# EAGLE design MSP-EXP430FR2311 (EAGLE 6.6.0)
REV: 1.0

## Sheet 1 of 6
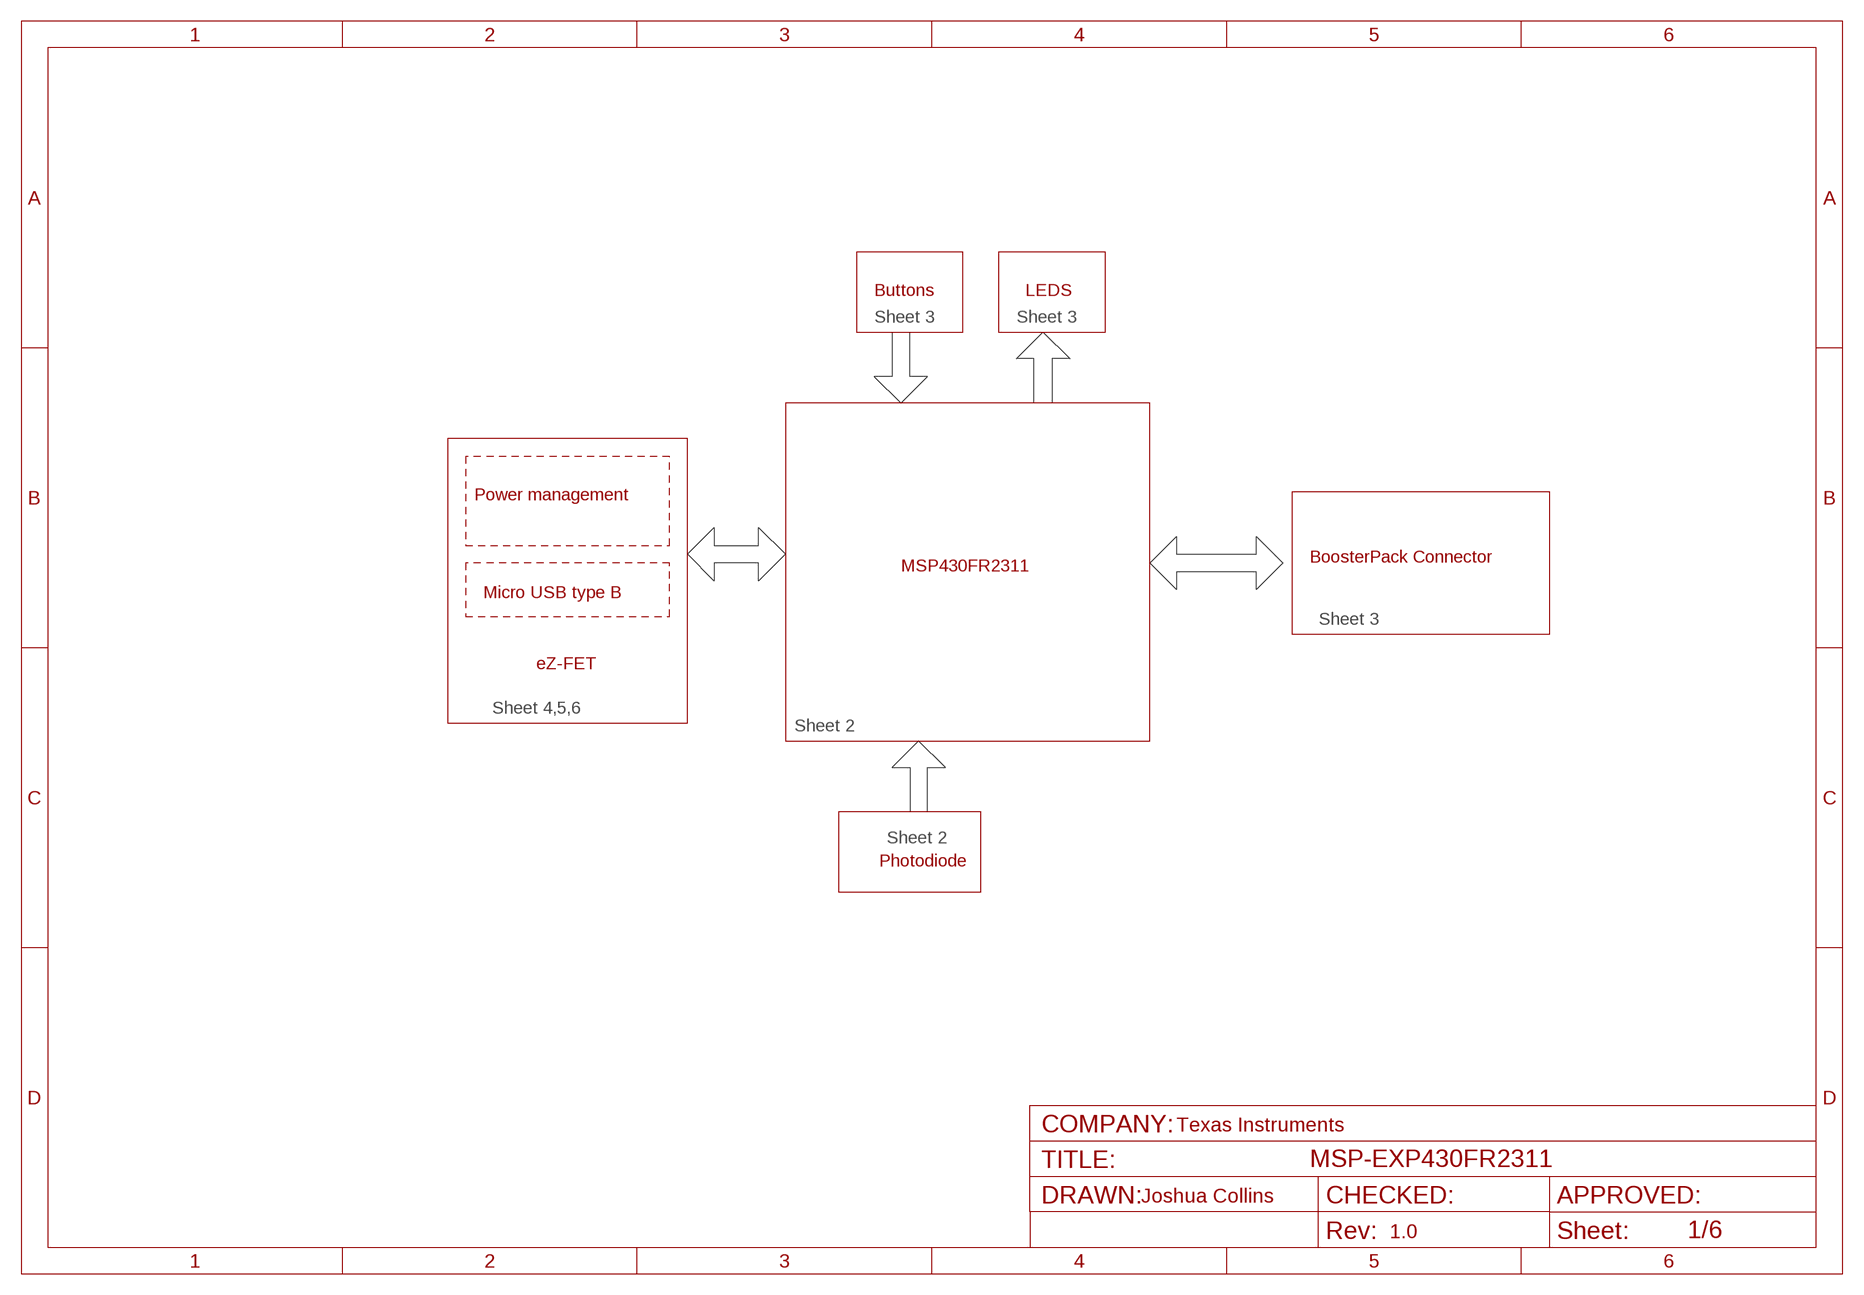
[diagram p0: schematic, sheet 1]

### Notes on the sheet
- Buttons | LEDS
- Sheet 3 | Sheet 3
- Power management
- BoosterPack Connector
- MSP430FR2311
- Micro USB type B
- Sheet 3
- eZ-FET
- Sheet 4,5,6
- Sheet 2
- Sheet 2
- Photodiode
- Texas Instruments
- Joshua Collins

## Sheet 2 of 6
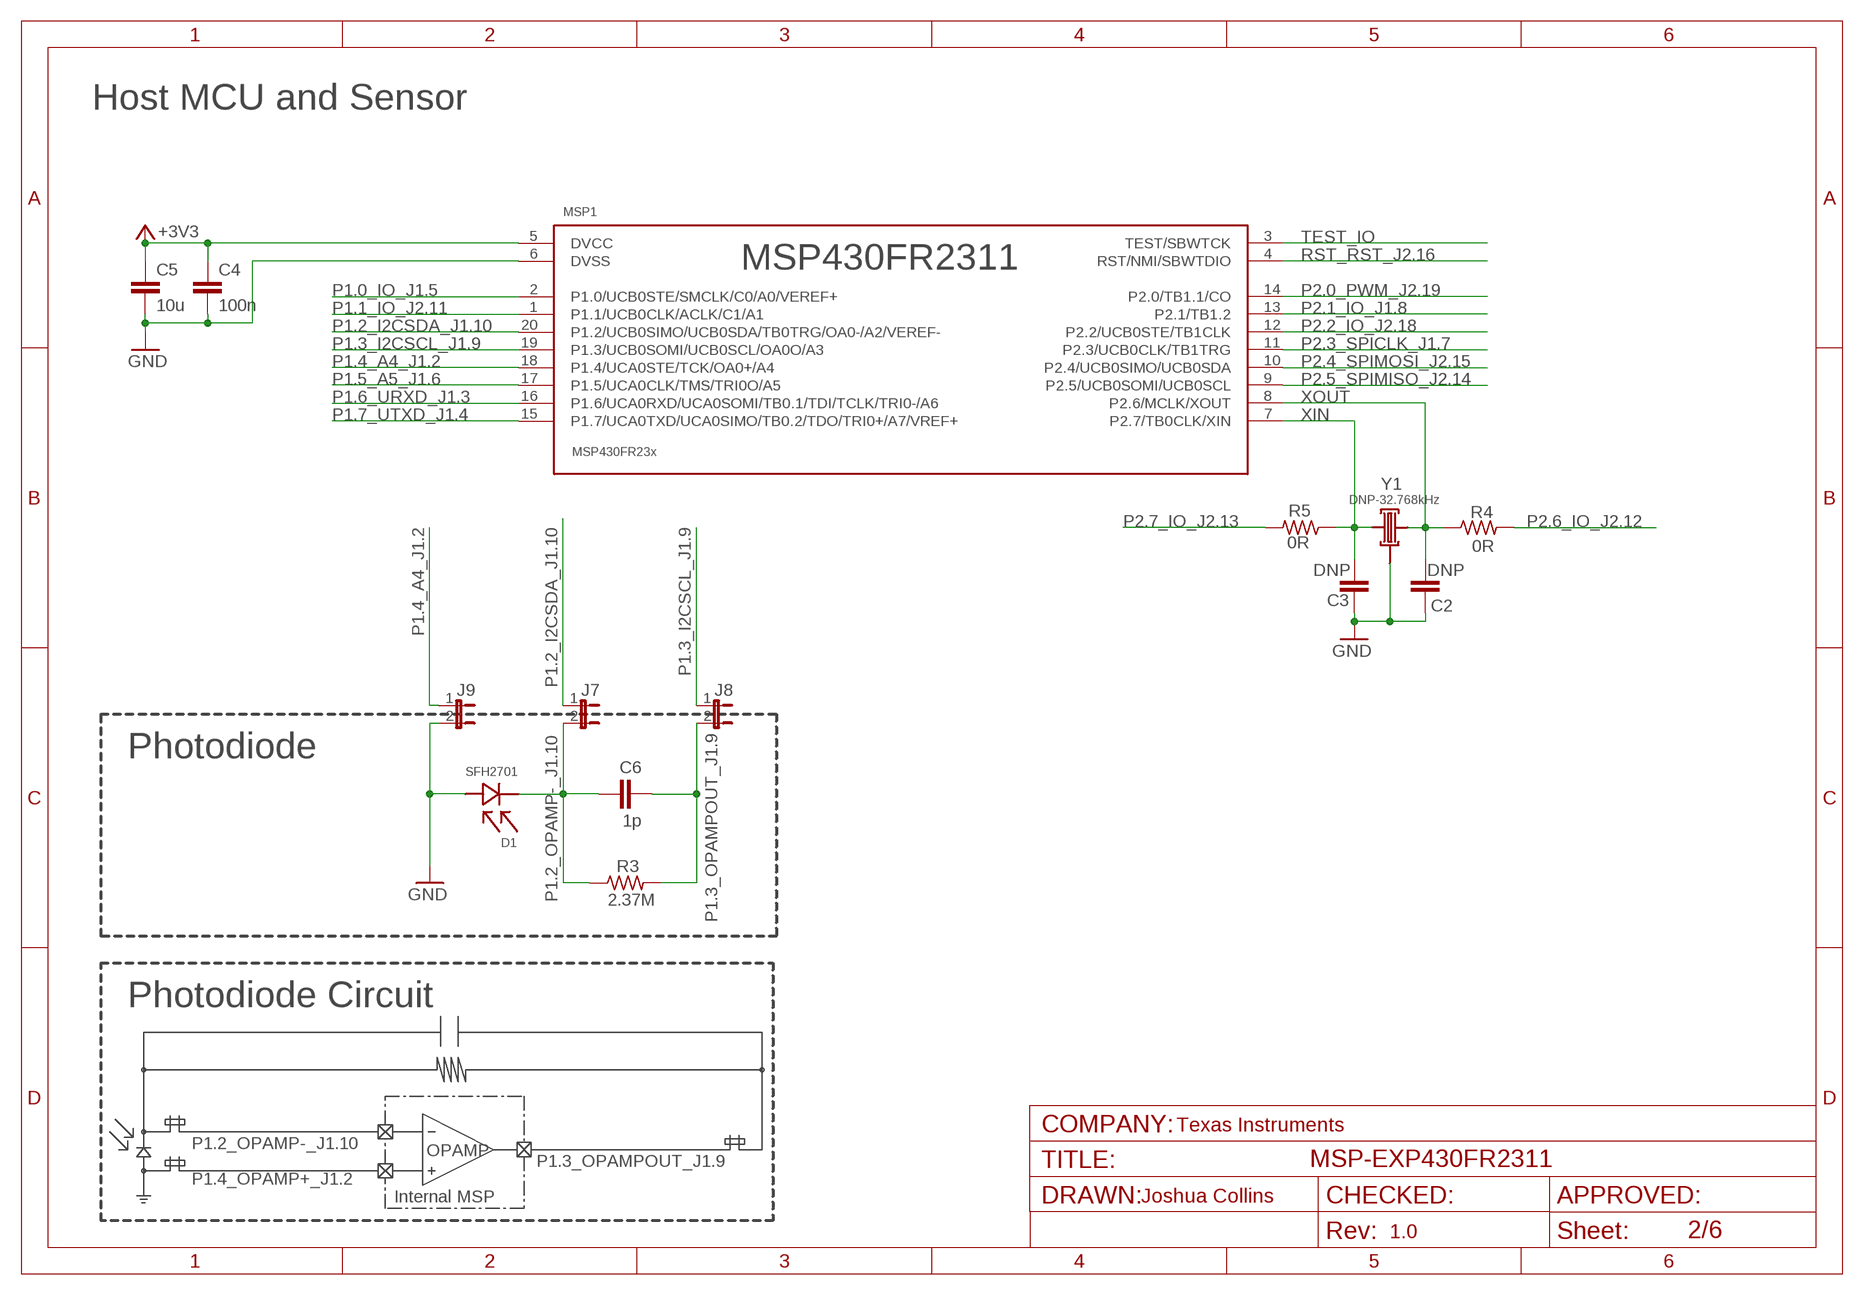
[diagram p1: schematic, sheet 2]

### Parts
C2  DNP  C-EUCM0402  [0402]
C3  DNP  C-EUCM0402  [0402]
C4  100n  C-EUCM0402  [0402]
C5  10u  C-EUC0603  [C0603]
C6  1p  C-EUC0603  [C0603]
D1  SFH2701  [1206-OSRAM]
J7  JUMPER_2.51MM  [JUMPER-2.54]
J8  JUMPER_2.51MM  [JUMPER-2.54]
J9  JUMPER_2.51MM  [JUMPER-2.54]
MSP1  MSP430FR2311IPW20"  [PW20]
R3  2.37M  RESR0603  [0603]
R4  0R  R-US_RM0402  [0402]
R5  0R  R-US_RM0402  [0402]
Y1  DNP - 32.768kHz  MULTI-CRYSTAL  [MULTI-CRYSTAL]

### Nets
+3V3: C4.1 C5.1 MSP1.5(DVCC) ; also sheet 3,5
P1.0_IO_J1.5: MSP1.2(P1.0/UCB0STE/SMCLK/C0/A0/VEREF+) ; also sheet 3
P1.1_IO_J2.11: MSP1.1(P1.1/UCB0CLK/ACLK/C1/A1) ; also sheet 3
P1.2_I2CSDA_J1.10: J7.1 MSP1.20(P1.2/UCB0SIMO/UCB0SDA/TB0TRG/OA0-/A2/VEREF-) ; also sheet 3
P1.2_OPAMP-_J1.10: C6.1 D1.C J7.2 R3.1
P1.3_I2CSCL_J1.9: J8.1 MSP1.19(P1.3/UCB0SOMI/UCB0SCL/OA0O/A3) ; also sheet 3
P1.3_OPAMPOUT_J1.9: C6.2 J8.2 R3.2
P1.4_A4_J1.2: J9.1 MSP1.18(P1.4/UCA0STE/TCK/OA0+/A4) ; also sheet 3
P1.5_A5_J1.6: MSP1.17(P1.5/UCA0CLK/TMS/TRI0O/A5) ; also sheet 3
P1.6_URXD_J1.3: MSP1.16(P1.6/UCA0RXD/UCA0SOMI/TB0.1/TDI/TCLK/TRI0-/A6) ; also sheet 3,5
P1.7_UTXD_J1.4: MSP1.15(P1.7/UCA0TXD/UCA0SIMO/TB0.2/TDO/TRI0+/A7/VREF+) ; also sheet 3,5
P2.0_PWM_J2.19: MSP1.14(P2.0/TB1.1/CO) ; also sheet 3
P2.1_IO_J1.8: MSP1.13(P2.1/TB1.2) ; also sheet 3
P2.2_IO_J2.18: MSP1.12(P2.2/UCB0STE/TB1CLK) ; also sheet 3
P2.3_SPICLK_J1.7: MSP1.11(P2.3/UCB0CLK/TB1TRG) ; also sheet 3
P2.4_SPIMOSI_J2.15: MSP1.10(P2.4/UCB0SIMO/UCB0SDA) ; also sheet 3
P2.5_SPIMISO_J2.14: MSP1.9(P2.5/UCB0SOMI/UCB0SCL) ; also sheet 3
P2.6_IO_J2.12: R4.2 ; also sheet 3
P2.7_IO_J2.13: R5.2 ; also sheet 3
RST_RST_J2.16: MSP1.4(RST/NMI/SBWTDIO) ; also sheet 3,5
TEST_IO: MSP1.3(TEST/SBWTCK) ; also sheet 5
TGT_GND: C2.2 C3.2 C4.2 C5.2 D1.A J9.2 MSP1.6(DVSS) Y1.GND@0(GND) ; supply symbol labelled GND ; also sheet 3,5
XIN: C3.1 MSP1.7(P2.7/TB0CLK/XIN) R5.1 Y1.1
XOUT: C2.1 MSP1.8(P2.6/MCLK/XOUT) R4.1 Y1.2

### Notes on the sheet
- Host MCU and Sensor
- MSP430FR2311
- DNP-32.768kHz
- Photodiode
- Photodiode Circuit
- Texas Instruments
- P1.2_OPAMP-_J1.10
- OPAMP
- P1.3_OPAMPOUT_J1.9
- P1.4_OPAMP+_J1.2
- Internal MSP | Joshua Collins

## Sheet 3 of 6
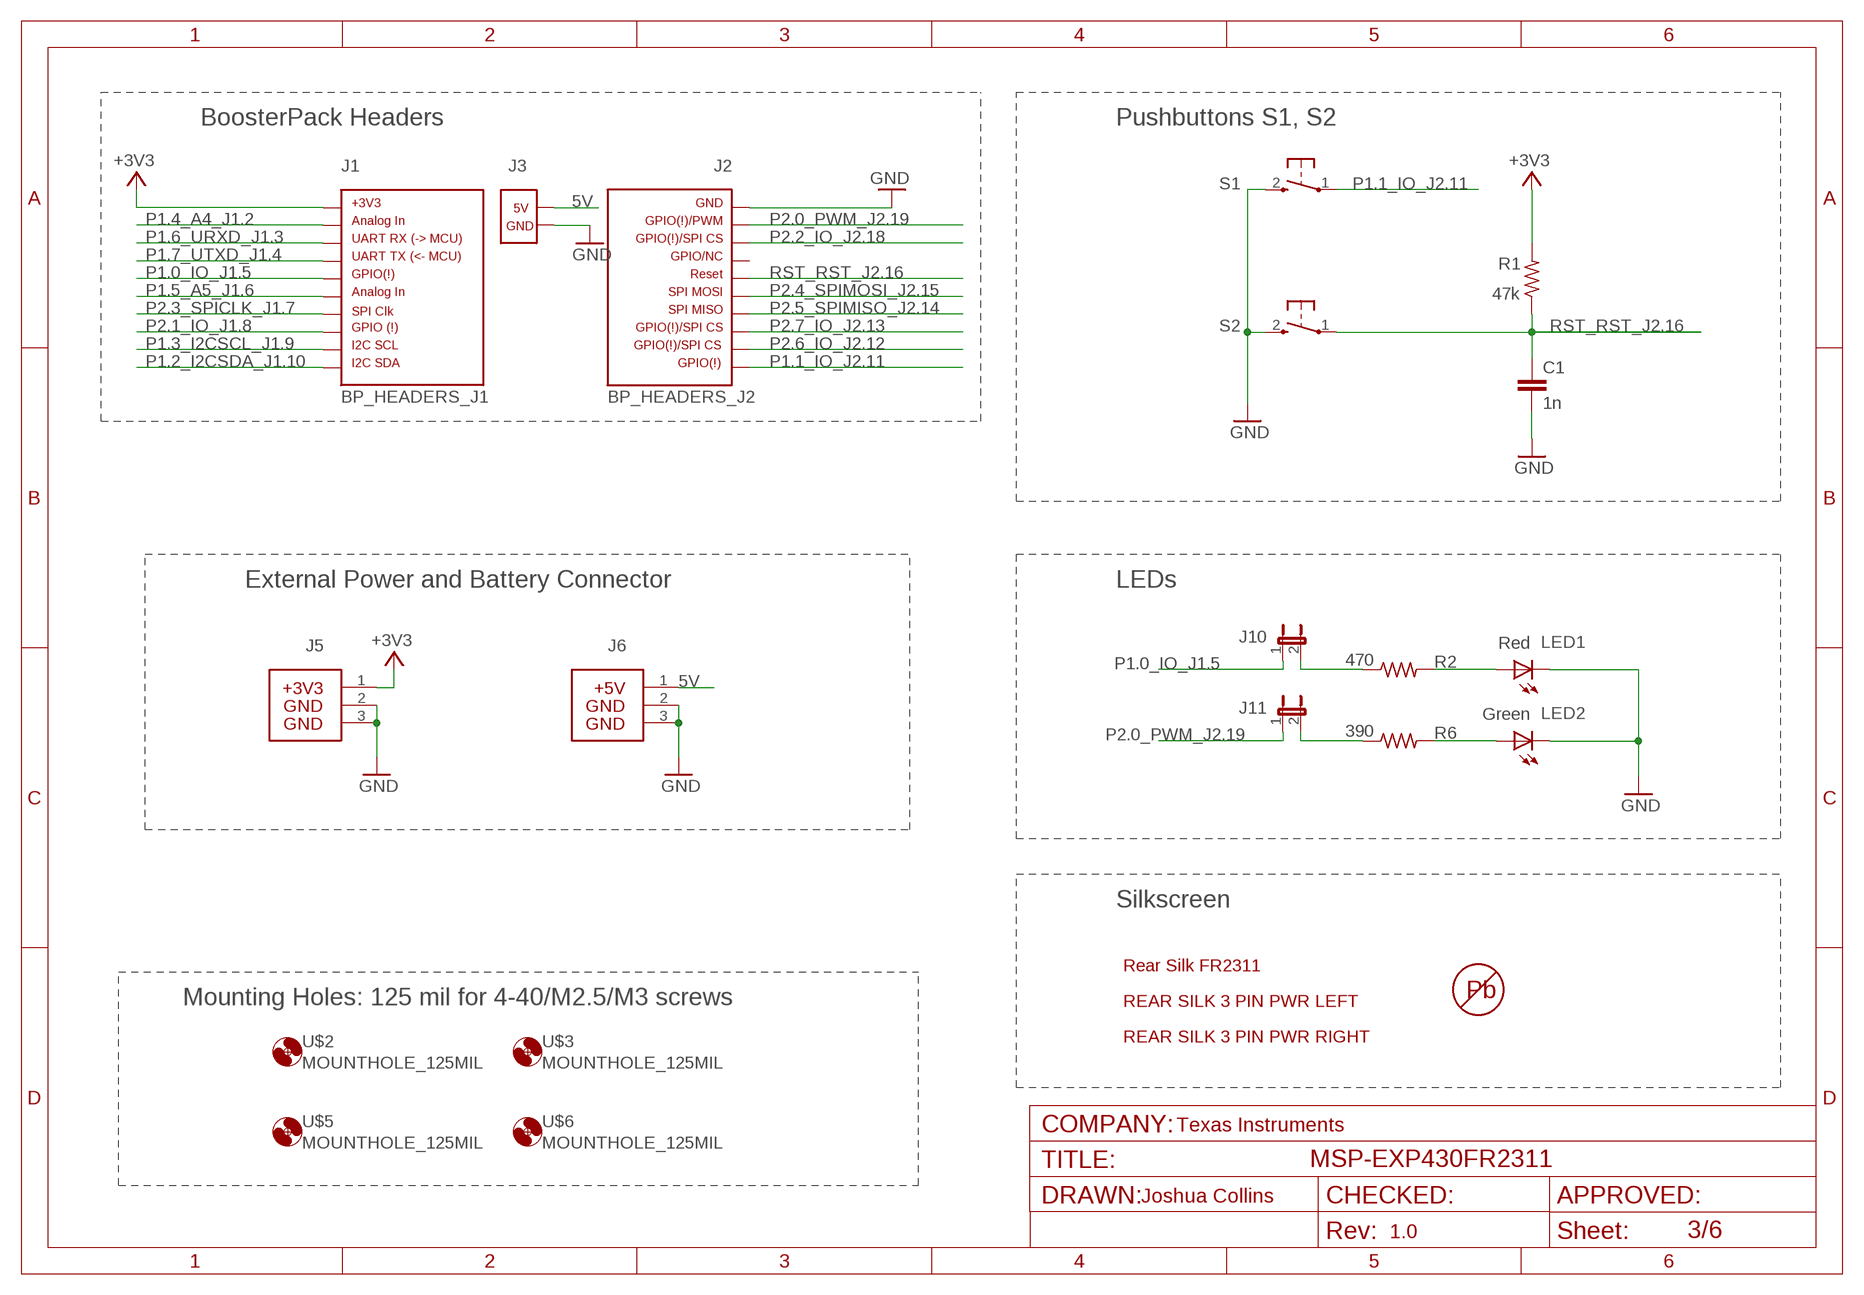
[diagram p2: schematic, sheet 3]

### Parts
C1  1n  C-EUCM0402  [0402]
J1  BP_HEADERS_J1  [J1]
J2  BP_HEADERS_J2  [J2]
J3  BP_2PIN_J3_HEADER  [2PIN_PWR_5V]
J5  HEADER 1X03  BP_HEADERS_PWR_3V3100-TH  [3PIN_PWR_3V3]
J6  BP_HEADERS_PWR_5V  [3PIN_PWR_5V]
J10  JUMPER_2.51MM  [JUMPER-2.54]
J11  JUMPER_2.51MM  [JUMPER-2.54]
LED1  Red  CHIP-LED  [LED0805]
LED2  Green  CHIP-LED  [LED0805]
R1  47k  R-US_RM0402  [0402]
R2  470  R-US_RM0402  [0402]
R6  390  R-US_RM0402  [0402]
S1  PB  [PBTH]
S2  PB  [PBTH]
U$1  REAR_SILK_FR2311  [SILK_REAR_FR2311]
U$2  MOUNTHOLE_125MIL  [MOUNTHOLE_125MIL]
U$3  MOUNTHOLE_125MIL  [MOUNTHOLE_125MIL]
U$5  MOUNTHOLE_125MIL  [MOUNTHOLE_125MIL]
U$6  MOUNTHOLE_125MIL  [MOUNTHOLE_125MIL]
U$7  PB-FREE  [PB-FREE]
U$8  BP_3PIN_SILK  [3PIN_PWR_SILK]
U$9  P  [P]
U$10  BP_3PIN_SILK_RT  [3PIN_PWR_SILK_RT]

### Nets
5V: J3.21 J6.1 ; also sheet 5
+3V3: J1.1 J5.1 R1.2 ; also sheet 2,5
N$3: J11.2 R6.1
N$4: LED2.A R6.2
N$6: J10.2 R2.1
N$7: LED1.A R2.2
P1.0_IO_J1.5: J1.5 J10.1 ; also sheet 2
P1.1_IO_J2.11: J2.11 S1.1(P) ; also sheet 2
P1.2_I2CSDA_J1.10: J1.10 ; also sheet 2
P1.3_I2CSCL_J1.9: J1.9 ; also sheet 2
P1.4_A4_J1.2: J1.2 ; also sheet 2
P1.5_A5_J1.6: J1.6 ; also sheet 2
P1.6_URXD_J1.3: J1.3 ; also sheet 2,5
P1.7_UTXD_J1.4: J1.4 ; also sheet 2,5
P2.0_PWM_J2.19: J2.19 J11.1 ; also sheet 2
P2.1_IO_J1.8: J1.8 ; also sheet 2
P2.2_IO_J2.18: J2.18 ; also sheet 2
P2.3_SPICLK_J1.7: J1.7 ; also sheet 2
P2.4_SPIMOSI_J2.15: J2.15 ; also sheet 2
P2.5_SPIMISO_J2.14: J2.14 ; also sheet 2
P2.6_IO_J2.12: J2.12 ; also sheet 2
P2.7_IO_J2.13: J2.13 ; also sheet 2
RST_RST_J2.16: C1.1 J2.16 R1.1 S2.1(P) ; also sheet 2,5
TGT_GND: C1.2 J2.20 J3.22 J5.2 J5.3 J6.2 J6.3 LED1.C LED2.C S1.2(S) S2.2(S) ; supply symbol labelled GND ; also sheet 2,5
Unconnected: J2.17

### Notes on the sheet
- BoosterPack Headers | Pushbuttons S1, S2
- External Power and Battery Connector | LEDs
- Silkscreen
- Mounting Holes: 125 mil for 4-40/M2.5/M3 screws
- Texas Instruments
- Joshua Collins

## Sheet 4 of 6
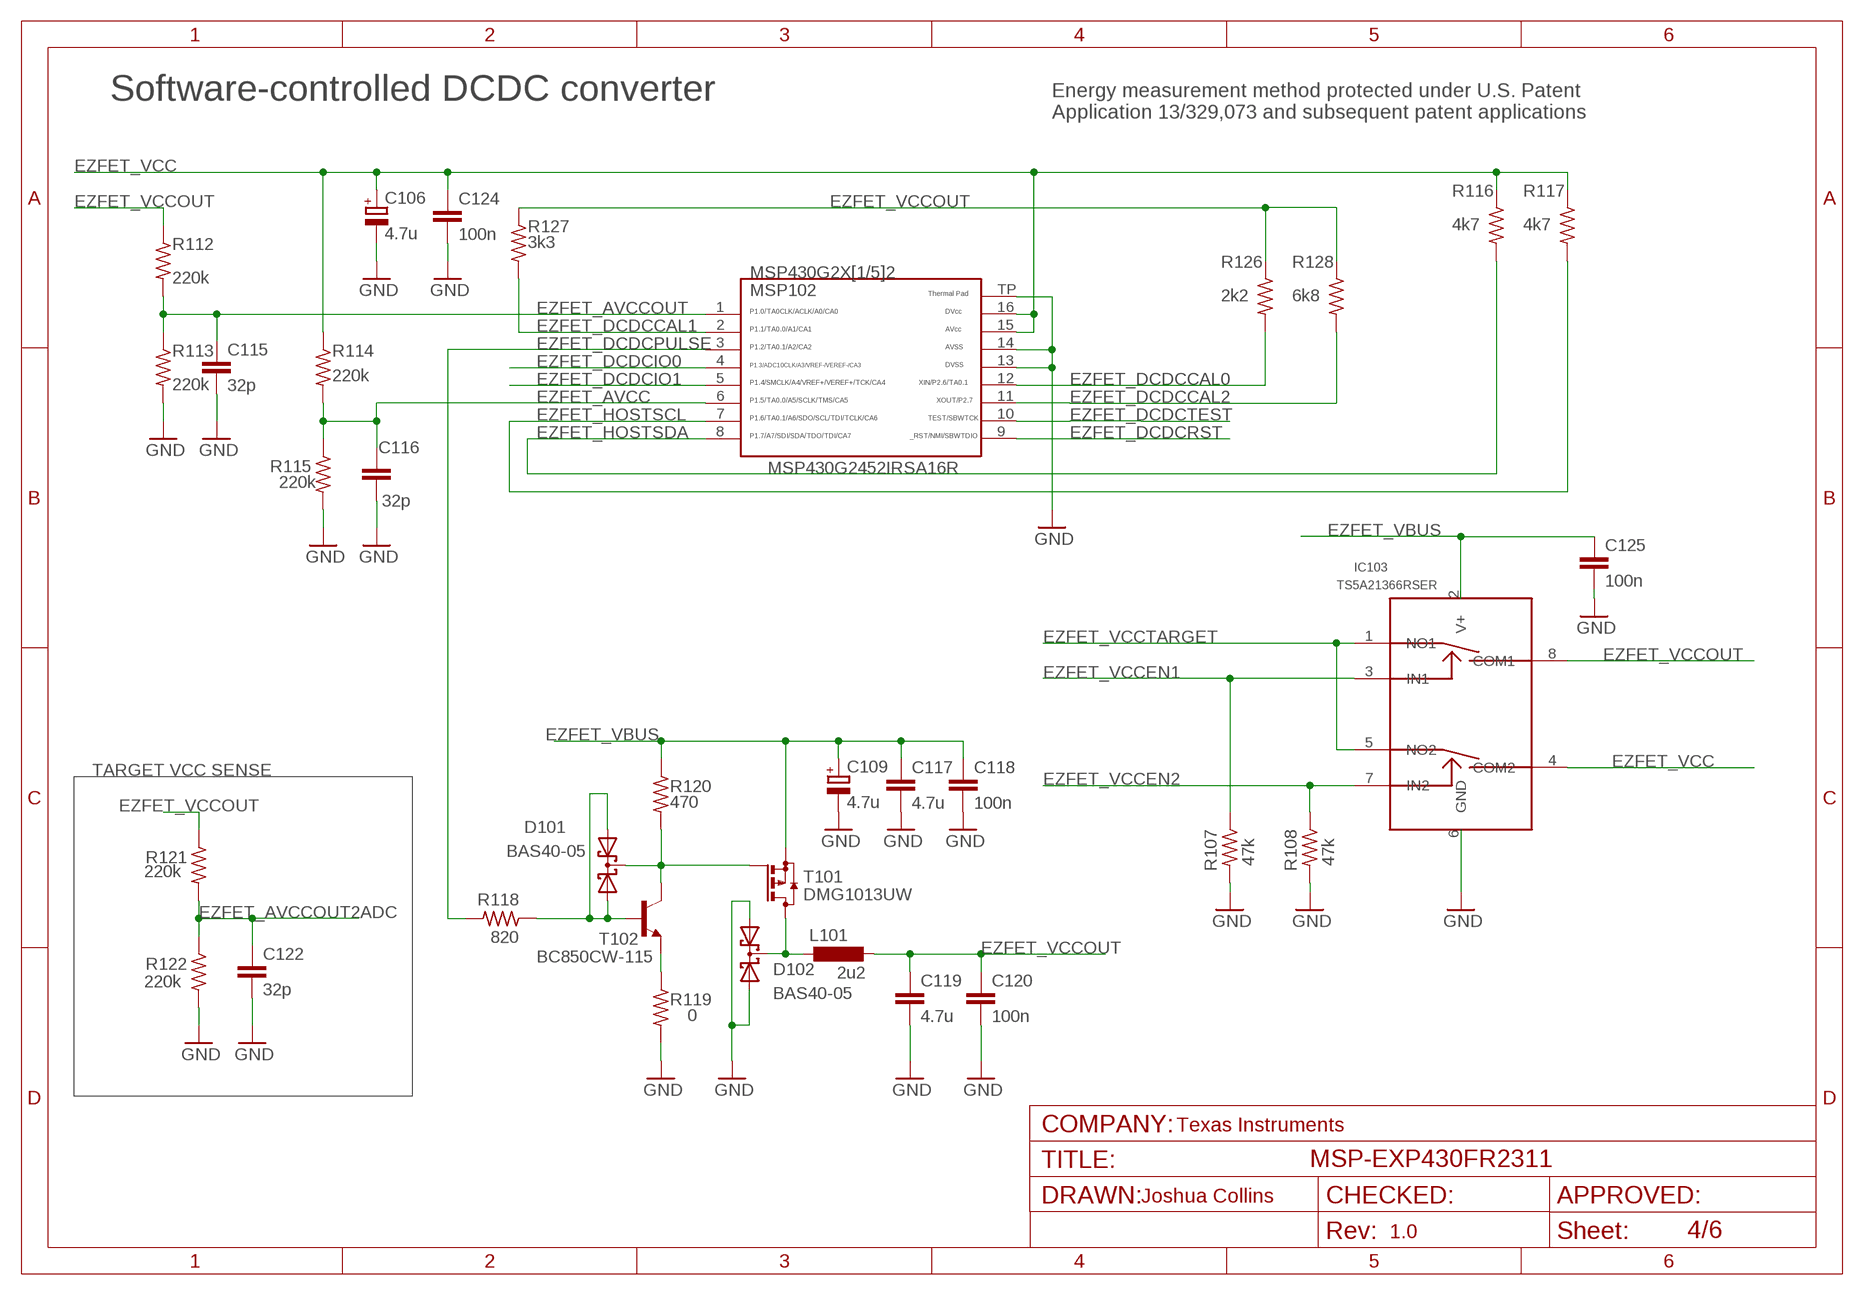
[diagram p3: schematic, sheet 4]

### Parts
C106  4.7u  CPOL-EUA/3216-18R  [A/3216-18R]
C109  4.7u  CPOL-EUA/3216-18R  [A/3216-18R]
C115  32p  C-EUCM0402  [0402]
C116  32p  C-EUCM0402  [0402]
C117  4.7u  C-EUC0603  [C0603]
C118  100n  C-EUCM0402  [0402]
C119  4.7u  C-EUC0603  [C0603]
C120  100n  C-EUCM0402  [0402]
C122  32p  C-EUCM0402  [0402]
C124  100n  C-EUCM0402  [0402]
C125  100n  C-EUCM0402  [0402]
D101  BAS40-05  BAS40-05W  [SOT323]
D102  BAS40-05  BAS40-05W  [SOT323]
IC103  TS5A21366RSER  [UQFN_RSE]
L101  2u2  L-EUL3216C  [L3216C]
MSP102  MSP430G2452IRSA16R  G2X[1/5]2---RSA16  [RSA16]
R107  47k  R-US_RM0402  [0402]
R108  47k  R-US_RM0402  [0402]
R112  220k  R-US_RM0402  [0402]
R113  220k  R-US_RM0402  [0402]
R114  220k  R-US_RM0402  [0402]
R115  220k  R-US_RM0402  [0402]
R116  4k7  R-US_RM0402  [0402]
R117  4k7  R-US_RM0402  [0402]
R118  820  R-US_RM0402  [0402]
R119  0  R-US_RM0402  [0402]
R120  470  R-US_RM0402  [0402]
R121  220k  R-US_RM0402  [0402]
R122  220k  R-US_RM0402  [0402]
R126  2k2  R-US_RM0402  [0402]
R127  3k3  R-US_RM0402  [0402]
R128  6k8  R-US_RM0402  [0402]
T101  DMG1013UW  [SOT323]
T102  BC850CW-115  [SOT323]

### Nets
EZFET_AVCC: C116.2 MSP102.6 R114.2 R115.1
EZFET_AVCCOUT: C115.2 MSP102.1 R112.2 R113.1
EZFET_AVCCOUT2ADC: C122.2 R121.2 R122.1 ; also sheet 5
EZFET_DCDCCAL0: MSP102.12 R126.2
EZFET_DCDCCAL1: MSP102.2 R127.2
EZFET_DCDCCAL2: MSP102.11 R128.2
EZFET_DCDCIO0: MSP102.4 ; also sheet 5
EZFET_DCDCIO1: MSP102.5 ; also sheet 5
EZFET_DCDCPULSE: MSP102.3 R118.2 ; also sheet 5
EZFET_DCDCRST: MSP102.9 ; also sheet 5,6
EZFET_DCDCTEST: MSP102.10 ; also sheet 5,6
EZFET_HOSTSCL: MSP102.7 R117.2 ; also sheet 5
EZFET_HOSTSDA: MSP102.8 R116.2 ; also sheet 5
EZFET_VBUS: C109.+ C117.1 C118.1 C125.1 IC103.2(V+) R120.1 T101.2(S) ; also sheet 5,6
EZFET_VCC: C106.+ C124.1 IC103.4(COM2) MSP102.15 MSP102.16 R114.1 R116.1 R117.1 ; also sheet 5,6
EZFET_VCCEN1: IC103.3(IN1) R107.1 ; also sheet 5
EZFET_VCCEN2: IC103.7(IN2) R108.1 ; also sheet 5
EZFET_VCCOUT: C119.1 C120.1 IC103.8(COM1) L101.2 R112.1 R121.1 R126.1 R127.1 R128.1
EZFET_VCCTARGET: IC103.1(NO1) IC103.5(NO2) ; also sheet 5
GND: C106.- C109.- C115.1 C116.1 C117.2 C118.2 C119.2 C120.2 C122.1 C124.2 C125.2 D102.1(A1) D102.2(A2) IC103.6(GND) MSP102.13 MSP102.14 MSP102.TP R107.2 R108.2 R113.2 R115.2 R119.2 R122.2 ; also sheet 5,6
N$12: R119.1 T102.2(E)
N$13: D101.1(A1) D101.2(A2) R118.1 T102.1(B)
N$15: D102.3(C) L101.1 T101.3(D)
N$16: D101.3(C) R120.2 T101.1(G) T102.3(C)

### Notes on the sheet
- Software-controlled DCDC converter
- Energy measurement method protected under U.S. Patent 
  Application 13/329,073 and subsequent patent applications
- MSP430G2452IRSA16R
- TARGET VCC SENSE
- Texas Instruments
- Joshua Collins

## Sheet 5 of 6
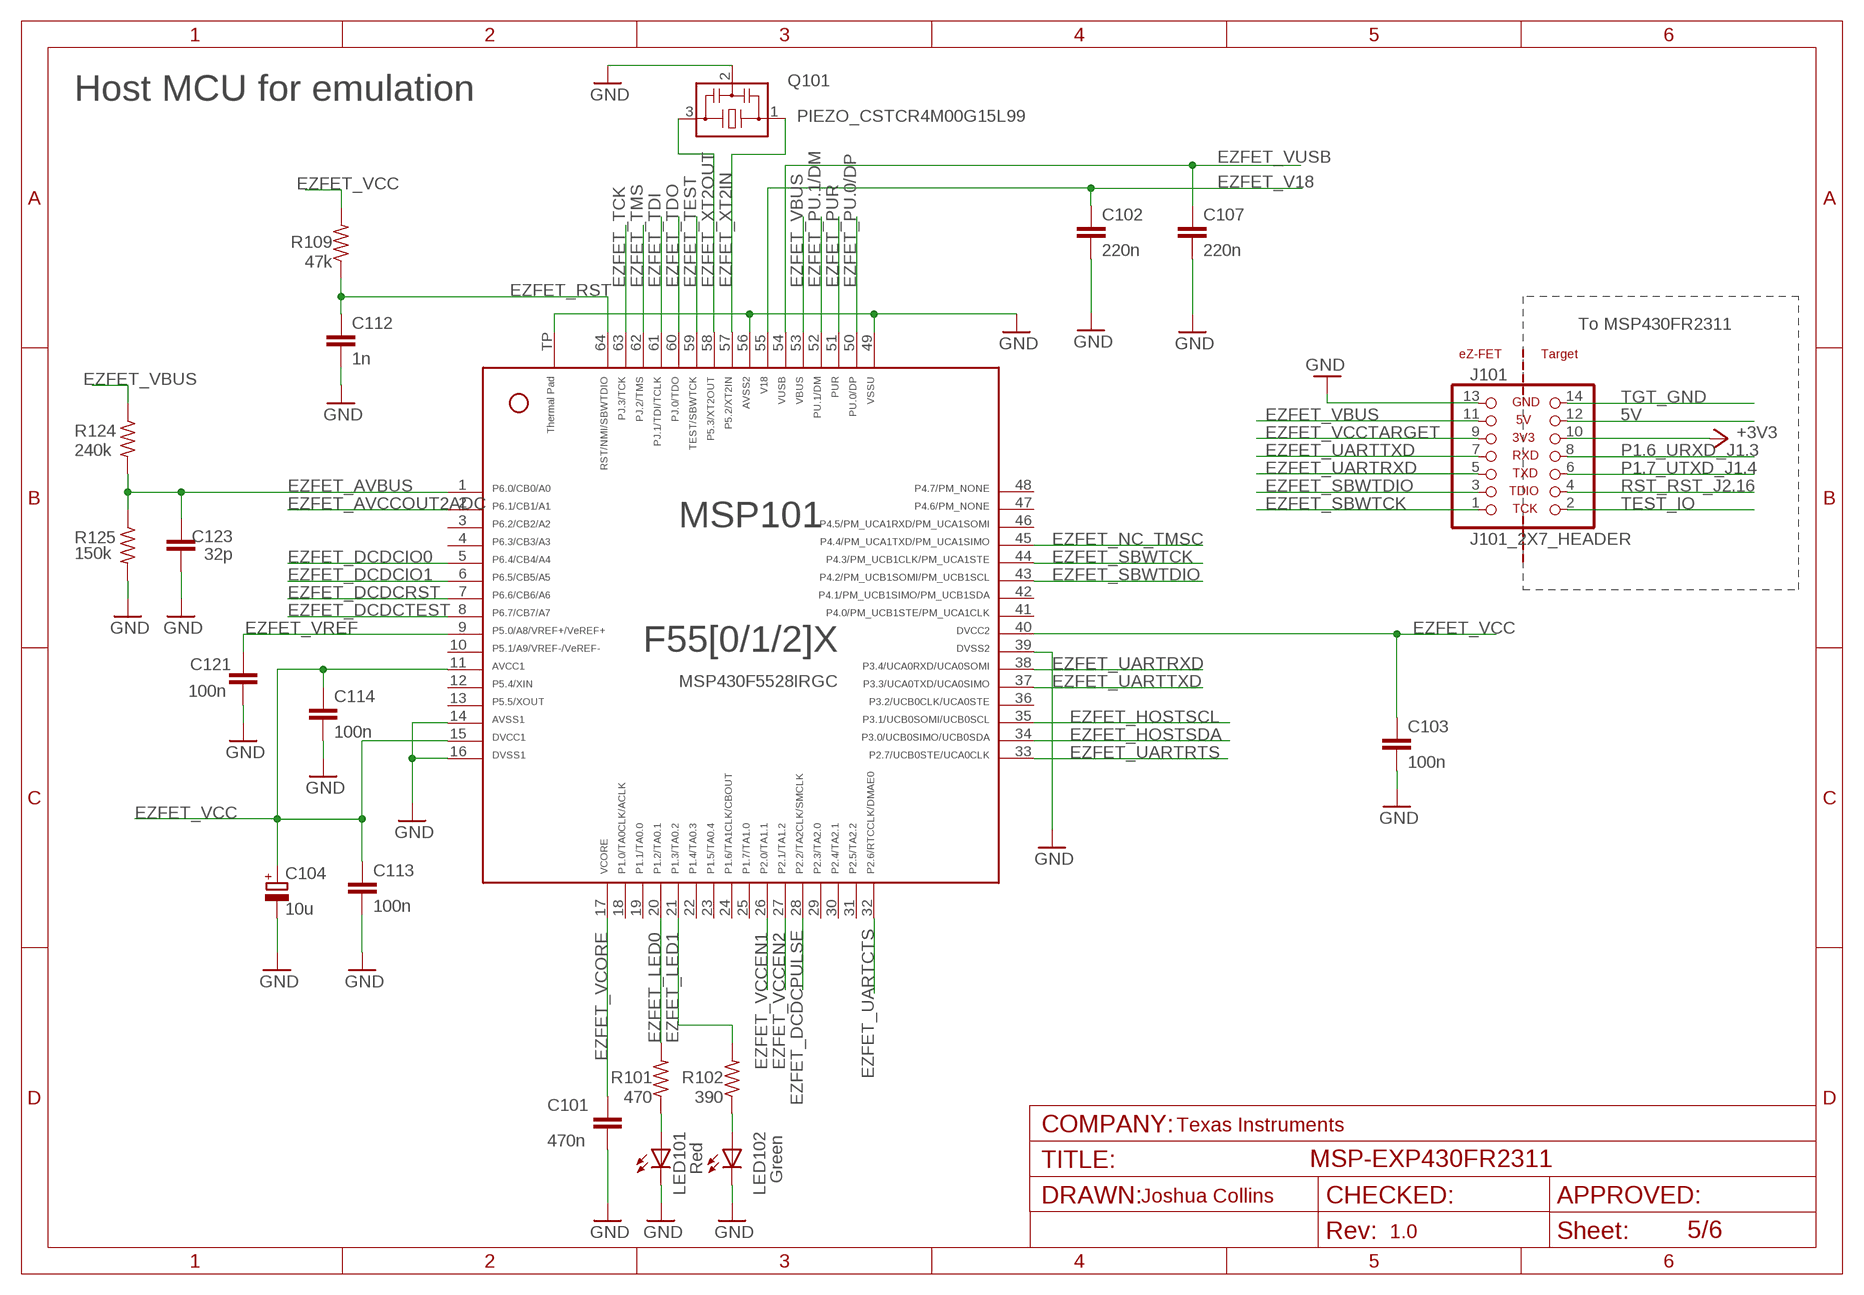
[diagram p4: schematic, sheet 5]

### Parts
C101  470n  C-EUCM0402  [0402]
C102  220n  C-EUCM0402  [0402]
C103  100n  C-EUCM0402  [0402]
C104  10u  CPOL-EUA/3216-18R  [A/3216-18R]
C107  220n  C-EUCM0402  [0402]
C112  1n  C-EUCM0402  [0402]
C113  100n  C-EUCM0402  [0402]
C114  100n  C-EUCM0402  [0402]
C121  100n  C-EUCM0402  [0402]
C123  32p  C-EUCM0402  [0402]
J101  J101_2X7_HEADER  [J101]
LED101  Red  CHIP-LED  [LED0805]
LED102  Green  CHIP-LED  [LED0805]
MSP101  MSP430F5528IRGC  F55[0/1/2]X---RGC64  [RGC64]
Q101  PIEZO_CSTCR4M00G15L99  CSTCR4M  [CSTCR4M]
R101  470  R-US_RM0402  [0402]
R102  390  R-US_RM0402  [0402]
R109  47k  R-US_RM0402  [0402]
R124  240k  R-US_RM0402  [0402]
R125  150k  R-US_RM0402  [0402]

### Nets
5V: J101.12 ; also sheet 3
+3V3: J101.10 ; also sheet 2,3
EZFET_AVBUS: C123.2 MSP101.1 R124.2 R125.1
EZFET_AVCCOUT2ADC: MSP101.2 ; also sheet 4
EZFET_DCDCIO0: MSP101.5 ; also sheet 4
EZFET_DCDCIO1: MSP101.6 ; also sheet 4
EZFET_DCDCPULSE: MSP101.28 ; also sheet 4
EZFET_DCDCRST: MSP101.7 ; also sheet 4,6
EZFET_DCDCTEST: MSP101.8 ; also sheet 4,6
EZFET_HOSTSCL: MSP101.35 ; also sheet 4
EZFET_HOSTSDA: MSP101.34 ; also sheet 4
EZFET_LED0: MSP101.20 R101.2
EZFET_LED1: MSP101.21 R102.2
EZFET_NC_TMSC: MSP101.45
EZFET_PU.0/DP: MSP101.50 ; also sheet 6
EZFET_PU.1/DM: MSP101.52 ; also sheet 6
EZFET_PUR: MSP101.51 ; also sheet 6
EZFET_RST: C112.1 MSP101.64 R109.1 ; also sheet 6
EZFET_SBWTCK: J101.1 MSP101.44
EZFET_SBWTDIO: J101.3 MSP101.43
EZFET_TCK: MSP101.63 ; also sheet 6
EZFET_TDI: MSP101.61 ; also sheet 6
EZFET_TDO: MSP101.60 ; also sheet 6
EZFET_TEST: MSP101.59 ; also sheet 6
EZFET_TMS: MSP101.62 ; also sheet 6
EZFET_UARTCTS: MSP101.32
EZFET_UARTRTS: MSP101.33
EZFET_UARTRXD: J101.5 MSP101.38
EZFET_UARTTXD: J101.7 MSP101.37
EZFET_V18: C102.1 MSP101.55
EZFET_VBUS: J101.11 MSP101.53 R124.1 ; also sheet 4,6
EZFET_VCC: C103.1 C104.+ C113.1 C114.1 MSP101.11 MSP101.15 MSP101.40 R109.2 ; also sheet 4,6
EZFET_VCCEN1: MSP101.26 ; also sheet 4
EZFET_VCCEN2: MSP101.27 ; also sheet 4
EZFET_VCCTARGET: J101.9 ; also sheet 4
EZFET_VCORE: C101.1 MSP101.17
EZFET_VREF: C121.1 MSP101.9
EZFET_VUSB: C107.1 MSP101.54
EZFET_XT2IN: MSP101.57 Q101.1
EZFET_XT2OUT: MSP101.58 Q101.3
GND: C101.2 C102.2 C103.2 C104.- C107.2 C112.2 C113.2 C114.2 C121.2 C123.1 J101.13 LED101.C LED102.C MSP101.14 MSP101.16 MSP101.39 MSP101.49 MSP101.56 MSP101.TP Q101.2 R125.2 ; also sheet 4,6
N$9: LED101.A R101.1
N$20: LED102.A R102.1
P1.6_URXD_J1.3: J101.8 ; also sheet 2,3
P1.7_UTXD_J1.4: J101.6 ; also sheet 2,3
RST_RST_J2.16: J101.4 ; also sheet 2,3
TEST_IO: J101.2 ; also sheet 2
TGT_GND: J101.14 ; also sheet 2,3
Unconnected: MSP101.3 MSP101.4 MSP101.10 MSP101.12 MSP101.13 MSP101.18 MSP101.19 MSP101.22 MSP101.23 MSP101.24 MSP101.25 MSP101.29 MSP101.30 MSP101.31 MSP101.36 MSP101.41 MSP101.42 MSP101.46 MSP101.47 MSP101.48

### Notes on the sheet
- Host MCU for emulation
- To MSP430FR2311
- MSP430F5528IRGC
- Texas Instruments
- Joshua Collins

## Sheet 6 of 6
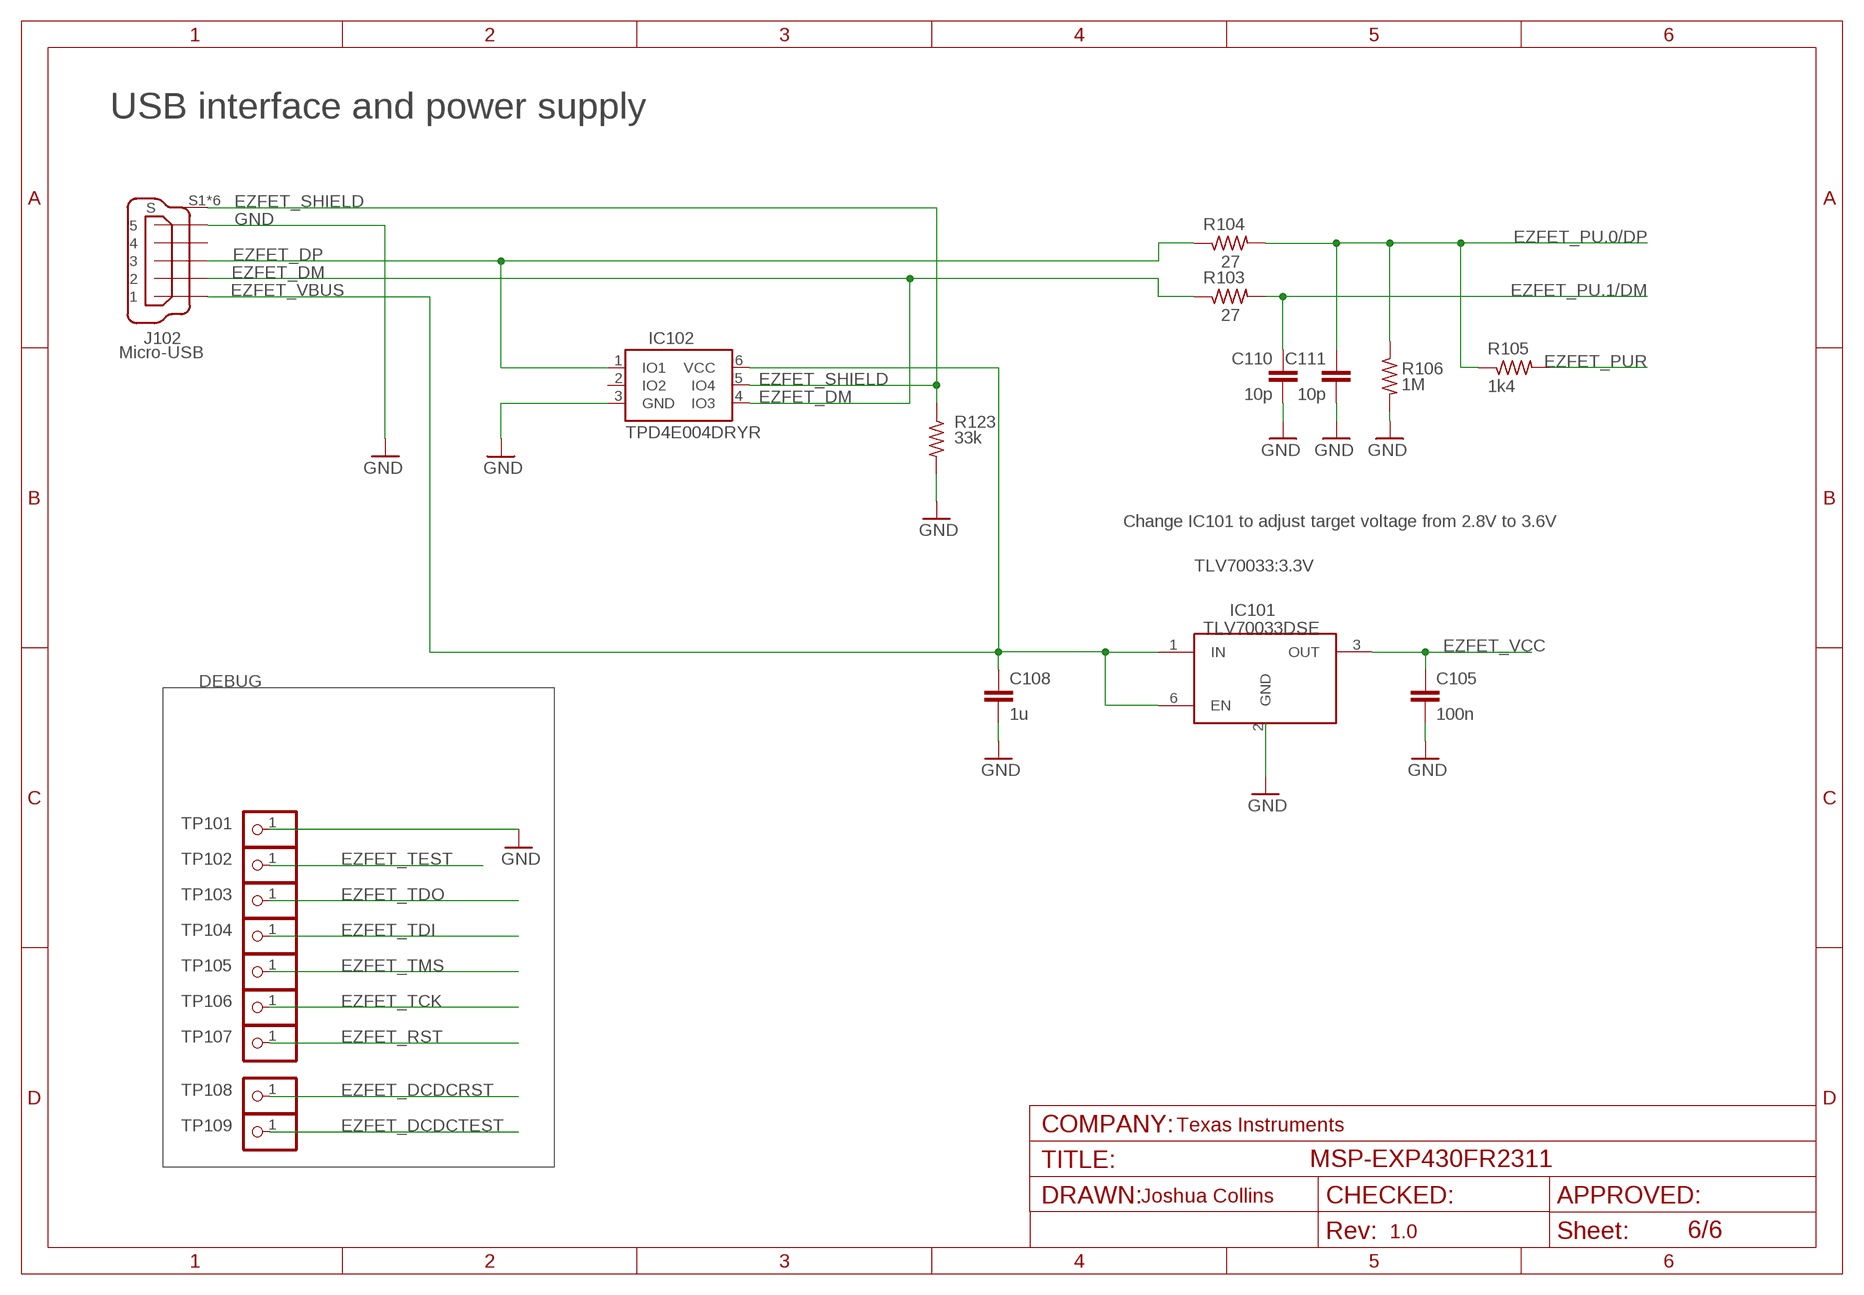
[diagram p5: schematic, sheet 6]

### Parts
C105  100n  C-EUCM0402  [0402]
C108  1u  C-EUC0603  [C0603]
C110  10p  C-EUCM0402  [0402]
C111  10p  C-EUCM0402  [0402]
IC101  TLV70033DSE  [WSON_DSE]
IC102  TPD4E004DRYR  TPD4E004  [SON(DRY)6]
J102  Micro-USB  EZFET_MINI-USB-  [EZFET_UX62M-B-5P]
R103  27  R-US_RM0402  [0402]
R104  27  R-US_RM0402  [0402]
R105  1k4  R-US_RM0402  [0402]
R106  1M  R-US_RM0402  [0402]
R123  33k  R-US_RM0402  [0402]
TP101  TEST_PIN2  PINHD-1X1  [1X01]
TP102  TEST_PIN2  PINHD-1X1  [1X01]
TP103  TEST_PIN2  PINHD-1X1  [1X01]
TP104  TEST_PIN2  PINHD-1X1  [1X01]
TP105  TEST_PIN2  PINHD-1X1  [1X01]
TP106  TEST_PIN2  PINHD-1X1  [1X01]
TP107  TEST_PIN2  PINHD-1X1  [1X01]
TP108  TEST_PIN2  PINHD-1X1  [1X01]
TP109  TEST_PIN2  PINHD-1X1  [1X01]

### Nets
EZFET_DCDCRST: TP108.1 ; also sheet 4,5
EZFET_DCDCTEST: TP109.1 ; also sheet 4,5
EZFET_DM: IC102.4(IO3) J102.2 R103.1
EZFET_DP: IC102.1(IO1) J102.3 R104.1
EZFET_PU.0/DP: C111.1 R104.2 R105.1 R106.1 ; also sheet 5
EZFET_PU.1/DM: C110.1 R103.2 ; also sheet 5
EZFET_PUR: R105.2 ; also sheet 5
EZFET_RST: TP107.1 ; also sheet 5
EZFET_SHIELD: IC102.5(IO4) J102.S1(S) J102.S2(S) J102.S3(S) J102.S4(S) J102.S5(S) J102.S6(S) R123.1
EZFET_TCK: TP106.1 ; also sheet 5
EZFET_TDI: TP104.1 ; also sheet 5
EZFET_TDO: TP103.1 ; also sheet 5
EZFET_TEST: TP102.1 ; also sheet 5
EZFET_TMS: TP105.1 ; also sheet 5
EZFET_VBUS: C108.1 IC101.1(IN) IC101.6(EN) IC102.6(VCC) J102.1 ; also sheet 4,5
EZFET_VCC: C105.1 IC101.3(OUT) ; also sheet 4,5
GND: C105.2 C108.2 C110.2 C111.2 IC101.2(GND) IC102.3(GND) J102.5 R106.2 R123.2 TP101.1 ; also sheet 4,5
Unconnected: IC102.2(IO2) J102.4

### Notes on the sheet
- USB interface and power supply
- Change IC101 to adjust target voltage from 2.8V to 3.6V
- TLV70033:3.3V
- TLV70033DSE
- DEBUG
- Texas Instruments
- Joshua Collins

## Library data of the parts
C1-C6 C101-C103 C105 C107 C108 C110-C125 = rcl:C-EU: CAPACITOR, European symbol
C104 C106 C109 = rcl:CPOL-EU: POLARIZED CAPACITOR, European symbol
D1 = MSP_IC:SFH2701
D101 D102 = MSP430G6_LP:BAS40-05W
IC101 = roy:TLV70033DSE: 200-mA, Low-I Q , Low-Dropout Regulator for Portable Devices
IC102 = eZFET:TPD4E004
IC103 = roy:TS5A21366RSER: 0.75-Ω DUAL SPST ANALOG SWITCH WITH 1.8-V COMPATIBLE INPUT LOGIC
J1 = LaunchPad_Template_Library:BP_HEADERS_J1
J2 = LaunchPad_Template_Library:BP_HEADERS_J2
J3 = LaunchPad_Template_Library:BP_2PIN_J3_HEADER
J5 = LaunchPad_Template_Library:BP_HEADERS_PWR_3V3; CCO: 258-0001299; DESCRIPTION: CONN HEADER .100 SINGL STR 3POS; MAN: SULLINS
J6 = LaunchPad_Template_Library:BP_HEADERS_PWR_5V
J7-J11 = launchpad:JUMPER_2.51MM
J101 = LaunchPad_Template_Library:J101_2X7_HEADER
J102 = MSP-EXP430G6021:EZFET_MINI-USB-: MINI USB Connector Source: http://www.hirose.co.jp/cataloge_hp/e24000019.pdf
L101 = rcl:L-EU: INDUCTOR, European symbol
LED1 LED2 LED101 LED102 = launchpad:CHIP-LED
MSP1 = MSP_IC:MSP430FR2311IPW20
MSP101 = TI_MSP430_v16:F55[0/1/2]X---RGC64: ***F55[0/1/2]X***RGC64 Rev. 1.0 06/2010 "http://www.ti.com/lit/gpn/msp430f5529" "http://www.ti.com/lit/gpn/msp430f5509" F5513/F5514 with limited Functions on some Pins
MSP102 = TI_MSP430_v16:G2X[1/5]2---RSA16: MSP430G2X[1/5]2 MSP430G2x52, MSP430G2x12 QFN (RSA) 16 Pin Package http://focus.ti.com/docs/prod/folders/print/msp430g2452.html
Q101 = MSP430G6_LP:CSTCR4M
R1 R2 R4-R6 R101-R109 R112-R128 = resistor:R-US_: RESISTOR, American symbol
R3 = MSP430_CapResistor:RES
S1 S2 = electricalmeter:PB: OMRON SWITCH
T101 = MSP430G6_LP:DMG1013UW
T102 = MSP430G6_LP:BC850CW-115
TP101-TP109 = pinhead:PINHD-1X1: PIN HEADER
U$1 = LaunchPad_Template_Library:REAR_SILK_FR2311
U$2 U$3 U$5 U$6 = MSP-EXP432:MOUNTHOLE_125MIL
U$7 = LaunchPad_Template_Library:PB-FREE
U$8 = LaunchPad_Template_Library:BP_3PIN_SILK
U$9 = LP_Silkscreen:P
U$10 = LaunchPad_Template_Library:BP_3PIN_SILK_RT
Y1 = MSP_IC:MULTI-CRYSTAL

## Board
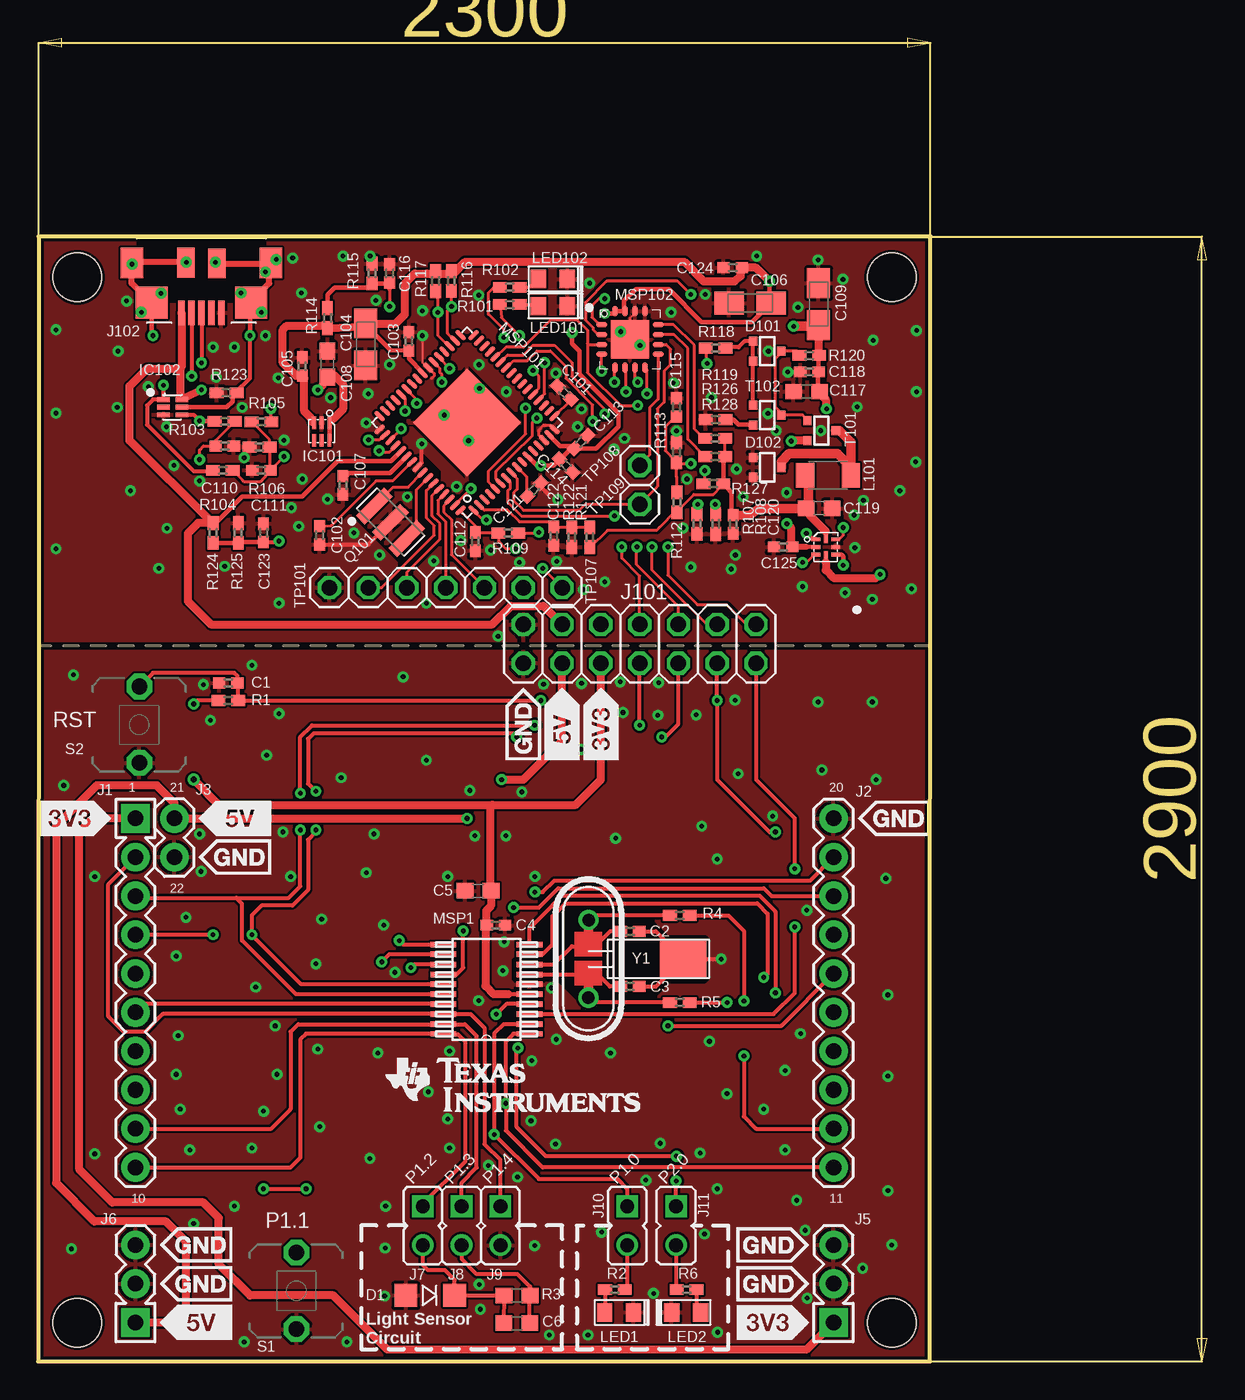
[diagram p6: board, top side]
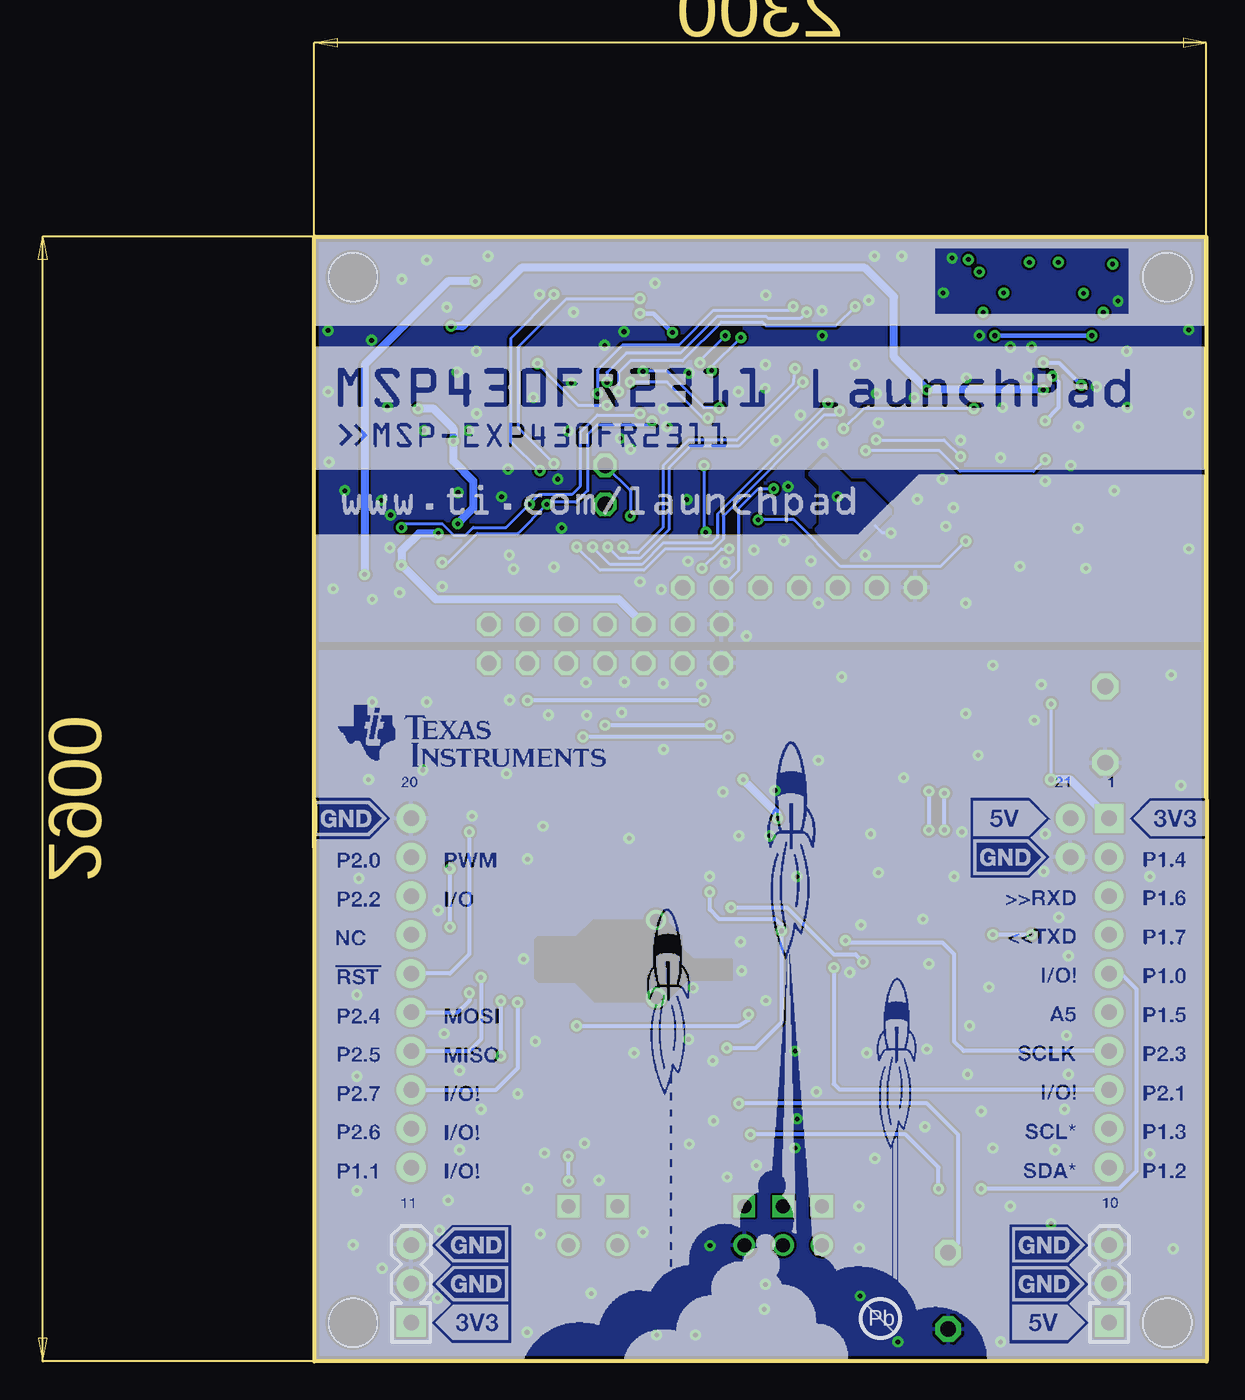
[diagram p7: board, bottom side, seen from below]

Size 58.45 x 73.66 mm. Coordinates in mm from the lower left corner, seen from the top.
Outline: 0,0 58.42,0 58.45,73.66 0.02,73.66 0,0
Copper layers (1*16): Top 0.0178mm / dielectric 12mil / Bottom 0.0178mm
Design rules "default": minimum track width 6mil, minimum drill 12mil, track to track 6mil, track to pad 6mil, pad to pad 6mil, via to via 8mil, smd to smd 0mil, copper to edge 8mil, drill to drill 8mil, minimum pad ring 10mil, minimum via ring 8mil, stop-mask expansion 3mil, vias tented up to drill 15mil, thermal gap 8mil
tRestrict: area 20.5,52.3 to 26.3,59.4; area 31.1,23.6 to 43.9,28.8
bRestrict: area 20.5,52.3 to 26.3,59.4; area 31.1,23.6 to 43.9,28.8

### Footprints (pad centres in the part's own frame; a part is rotated, then mirrored left to right if it is on the bottom)
0402 = smd 0.8 x 0.7: 1 -0.6,0; 2 0.6,0
C0603 = smd 1.1 x 1: 1 -0.85,0; 2 0.85,0
A/3216-18R = smd 1.95 x 1.5: + 1.375,0; - -1.375,0
1206-OSRAM = smd 1.5 x 1.5: A 0,-1.6; C 0,1.6
SOT323 = smd 0.6 x 0.55: 1 -0.65,-0.825; 2 0.65,-0.825; 3 0,1.025
WSON_DSE = smd 0.25 x 0.8: 1 0,0; 2 0.5,0; 3 1,0; 5 0.5,1.15; 6 0,1.15; P4 1,1.15
SON(DRY)6 = smd 0.81 x 0.305: 1 -0.1,0; 2 -0.1,-0.5; 3 -0.1,-1; 4 1.1,-1; 5 1.1,-0.5; 6 1.1,0
UQFN_RSE = smd 0.25 x 0.58: 1 -0.5,-0.65; 2 0,-0.65; 3 0.5,-0.65; 5 0.5,0.65; 6 0,0.65; 7 -0.5,0.65 | smd 0.58 x 0.25: 4 0.55,0; 8 -0.55,0
J1 = drill 1.016 pad 1.88 square: 1 0,22.86 | drill 1.016 pad 1.88: 2 0,20.32; 3 0,17.78; 4 0,15.24; 5 0,12.7; 6 0,10.16; 7 0,7.62; 8 0,5.08; 9 0,2.54; 10 0,0
J2 = drill 1.016 pad 1.88: 11 0,0; 12 0,2.54; 13 0,5.08; 14 0,7.62; 15 0,10.16; 16 0,12.7; 17 0,15.24; 18 0,17.78; 19 0,20.32; 20 0,22.86
2PIN_PWR_5V = drill 1.016 pad 1.88: 21 0,2.54; 22 0,0
3PIN_PWR_3V3 = drill 1.016 pad 1.88 square: 1 0,0 | drill 1.016 pad 1.88: 2 0,2.54; 3 0,5.08
3PIN_PWR_5V = drill 1.016 pad 1.88 square: 1 0,0 | drill 1.016 pad 1.88: 2 0,2.54; 3 0,5.08
JUMPER-2.54 = drill 0.914 square: 1 0,-1.27 | drill 0.914: 2 0,1.27
J101 = drill 1.016 octagon: 1 7.62,1.27; 2 7.62,-1.27; 3 5.08,1.27; 4 5.08,-1.27; 5 2.54,1.27; 6 2.54,-1.27; 7 0,1.27; 8 0,-1.27; 9 -2.54,1.27; 10 -2.54,-1.27; 11 -5.08,1.27; 12 -5.08,-1.27; 13 -7.62,1.27; 14 -7.62,-1.27
EZFET_UX62M-B-5P = smd 0.42 x 1.6: 1 1.3,1.3; 2 0.65,1.3; 3 0,1.3; 4 -0.65,1.3; 5 -1.3,1.3 | smd 2.1 x 2.1: S1 -3.25,0.65; S2 3.25,0.65 | smd 1.5 x 2: S3 -4.55,-1.95; S4 4.55,-1.95 | smd 1.144 x 1.949: S5 -1.016,-1.93; S6 1.016,-1.981
L3216C = smd 1.2 x 1.6: 1 -1.5,0; 2 1.5,0
LED0805 = smd 1 x 1.2: A 1.052,0.102; C -0.848,0.102
PW20 = smd 1.676 x 0.356: 1 0.991,6.366; 2 0.991,5.731; 3 0.991,5.071; 4 0.991,4.41; 5 0.991,3.775; 6 0.991,3.115; 7 0.991,2.48; 8 0.991,1.819; 9 0.991,1.159; 10 0.991,0.524; 11 6.629,0.524; 12 6.629,1.159; 13 6.629,1.819; 14 6.629,2.48; 15 6.629,3.115; 16 6.629,3.775; 17 6.629,4.41; 18 6.629,5.071; 19 6.629,5.731; 20 6.629,6.366
RGC64 = smd 0.825 x 0.28: 1 -4.36,3.75; 2 -4.36,3.25; 3 -4.36,2.75; 4 -4.36,2.25; 5 -4.36,1.75; 6 -4.36,1.25; 7 -4.36,0.75; 8 -4.36,0.25; 9 -4.36,-0.25; 10 -4.36,-0.75; 11 -4.36,-1.25; 12 -4.36,-1.75; 13 -4.36,-2.25; 14 -4.36,-2.75; 15 -4.36,-3.25; 16 -4.36,-3.75; 33 4.36,-3.75; 34 4.36,-3.25; 35 4.36,-2.75; 36 4.36,-2.25; 37 4.36,-1.75; 38 4.36,-1.25; 39 4.36,-0.75; 40 4.36,-0.25; 41 4.36,0.25; 42 4.36,0.75; 43 4.36,1.25; 44 4.36,1.75; 45 4.36,2.25; 46 4.36,2.75; 47 4.36,3.25; 48 4.36,3.75 | smd 0.28 x 0.825: 17 -3.75,-4.36; 18 -3.25,-4.36; 19 -2.75,-4.36; 20 -2.25,-4.36; 21 -1.75,-4.36; 22 -1.25,-4.36; 23 -0.75,-4.36; 24 -0.25,-4.36; 25 0.25,-4.36; 26 0.75,-4.36; 27 1.25,-4.36; 28 1.75,-4.36; 29 2.25,-4.36; 30 2.75,-4.36; 31 3.25,-4.36; 32 3.75,-4.36; 49 3.75,4.36; 50 3.25,4.36; 51 2.75,4.36; 52 2.25,4.36; 53 1.75,4.36; 54 1.25,4.36; 55 0.75,4.36; 56 0.25,4.36; 57 -0.25,4.36; 58 -0.75,4.36; 59 -1.25,4.36; 60 -1.75,4.36; 61 -2.25,4.36; 62 -2.75,4.36; 63 -3.25,4.36; 64 -3.75,4.36 | smd 5 x 5: TP 0,0
RSA16 = smd 0.7 x 0.35: 1 -1.85,0.975; 2 -1.85,0.325; 3 -1.85,-0.325; 4 -1.85,-0.975; 9 1.85,-0.975; 10 1.85,-0.325; 11 1.85,0.325; 12 1.85,0.975 | smd 0.35 x 0.7: 5 -0.975,-1.85; 6 -0.325,-1.85; 7 0.325,-1.85; 8 0.975,-1.85; 13 0.975,1.85; 14 0.325,1.85; 15 -0.325,1.85; 16 -0.975,1.85 | smd 2.5 x 2.5: TP 0,0
CSTCR4M = smd 0.8 x 2.6: 1 -1.5,0; 2 0,0; 3 1.5,0
0402' = smd 0.9 x 0.7: 1 -0.65,0; 2 0.65,0
0603 = smd 1.1 x 1: 1 -0.85,0; 2 0.85,0
PBTH = drill 1.016 pad 1.676 octagon: 1 -0.001,0.001; 2 5.001,0.001
1X01 = drill 1.016 octagon: 1 0,0
MOUNTHOLE_125MIL = hole 3.175: 0,0
MULTI-CRYSTAL = drill 0.813: 1 0.009,2.543; 2 -0.001,-2.533 | smd 3.048 x 2.54: GND@0 -6.208,0.008

### Placement (x,y rotation side)
C1  12.45,44.43 180 top
C2  38.76,28.16 0 top
C3  38.76,24.55 0 top
C4  29.99,28.57 0 top
C5  28.81,30.82 180 top
C6  31.35,2.5 0 top
C101  34.46,63.44 135 top
C102  18.44,54.1 270 top
C103  24.28,66.8 90 top
C104  21.46,66.6 90 top
C105  17.3,65.15 90 top
C106  46.63,69.31 0 top
C107  19.96,57.38 270 top
C108  18.95,65.3 90 top
C109  51.11,69.24 270 top
C110  12.22,59.94 0 top
C111  14.63,58.36 180 top
C112  28.63,53.69 270 top
C113  35.55,60.2 45 top
C114  34.57,58.67 315 top
C115  41.81,62.48 270 top
C116  23.01,71.25 270 top
C117  50.33,63.51 180 top
C118  50.51,64.81 180 top
C119  51.16,55.87 0 top
C120  45.52,54.83 270 top
C121  32.48,57.1 45 top
C122  33.77,54.05 90 top
C123  14.76,54.25 270 top
C124  45.49,71.63 180 top
C125  48.79,53.34 180 top
D1  25.68,4.32 270 top
D101  47.65,66.17 270 top
D102  47.65,58.55 270 top
DRAW1  [LOGO-ROCKET-10X7MM-BRD]  3.86,53.73 65 top
DRAW3  [LOGO-ROCKET-10X7MM-BRD]  18.78,31.97 7 top
IC101  19.07,61.47 180 top
IC102  8.31,62.99 0 top
IC103  51.59,53.34 270 top
J1  6.38,12.7 0 top
J2  52.1,12.7 0 top
J3  8.91,33.02 0 top
J5  52.1,2.54 0 bottom
J6  6.38,2.54 0 bottom
J7  25.19,8.88 180 top
J8  27.73,8.88 180 top
J9  30.27,8.88 180 top
J10  38.58,8.88 180 top
J11  41.78,8.88 180 top
J101  39.4,46.99 0 top
J102  10.69,69.98 180 top
L101  51.73,58.03 180 top
LED1  38.15,3.3 180 top
LED2  42.34,3.1 0 top
LED101  33.81,69.22 180 top
LED102  33.81,70.99 180 top
MSP1  33.17,27.81 180 top
MSP101  28.09,61.47 135 top
MSP102  38.76,66.93 0 top
Q101  23.08,54.95 315 top
R1  47k  [0402']  12.45,43.28 180 top
R2  470  [0402']  37.77,4.7 180 top
R3  31.37,4.31 0 top
R4  0R  [0402']  42.03,29.2 0 top
R5  0R  [0402']  42.03,23.5 0 top
R6  390  [0402']  42.47,4.7 0 top
R101  470  [0402']  30.89,69.22 180 top
R102  390  [0402']  30.89,70.34 180 top
R103  27  [0402']  12.22,61.56 0 top
R104  27  [0402']  12.09,58.36 0 top
R105  1k4  [0402']  14.63,61.53 0 top
R106  1M  [0402']  14.5,59.88 180 top
R107  47k  [0402']  43.15,54.84 270 top
R108  47k  [0402']  44.37,54.84 270 top
R109  47k  [0402']  30.79,54.24 0 top
R112  220k  [0402']  41.84,56.26 90 top
R113  220k  [0402']  41.81,59.54 90 top
R114  220k  [0402']  18.95,68.33 90 top
R115  220k  [0402']  21.87,71.25 90 top
R116  4k7  [0402']  27.06,70.75 270 top
R117  4k7  [0402']  26.03,70.75 270 top
R118  820  [0402']  44.37,66.36 180 top
R119  0  [0402']  44.37,61.68 180 top
R120  470  [0402']  50.51,65.87 180 top
R121  220k  [0402']  36.13,53.98 90 top
R122  220k  [0402']  34.95,53.98 270 top
R123  33k  [0402']  12.34,63.44 180 top
R124  240k  [0402']  11.46,54.25 270 top
R125  150k  [0402']  13.11,54.25 90 top
R126  2k2  [0402']  44.35,60.45 180 top
R127  3k3  [0402']  44.22,57.48 180 top
R128  6k8  [0402']  44.35,59.26 180 top
S1  16.92,7.11 270 top
S2  6.63,44.2 270 top
T101  51.21,60.96 270 top
T102  47.65,61.98 270 top
TP101  19.08,50.67 0 top
TP102  21.62,50.67 0 top
TP103  24.15,50.67 0 top
TP104  26.7,50.67 0 top
TP105  29.23,50.67 0 top
TP106  31.78,50.67 0 top
TP107  34.32,50.67 0 top
TP108  39.39,58.67 0 top
TP109  39.4,56.13 0 top
U$1  0.02,0 0 top
U$2  2.56,2.54 0 top
U$3  2.56,70.99 0 top
U$4  [LOGO16_TPLACE]  22.67,16.17 0 top
U$5  55.91,2.54 0 top
U$6  55.91,70.99 0 top
U$7  20.09,1.52 0 top
U$8  7.65,0.61 0 top
U$9  27.52,22.1 0 top
U$10  50.83,0.61 0 top
Y1  36.05,26.37 180 top

### Tracks (layer width: path | path; a pad name or v marks a point on that pad's centre or on a via)
5V  (via drill 0.3)
  Top 0.508: J6.1 8.91,2.54 9.68,3.3 9.68,7.85 8.36,9.17 3.68,9.17 1.17,11.68 1.17,35.05 3.83,37.72 7.77,37.72 8.91,36.58 J3.21 v28.09,35.56 | v30.35,38.1 31.78,38.1 34.32,40.64 J101.12
  Bottom 0.508: v28.09,35.56 28.09,35.84 v30.35,38.1
+3V3  (via drill 0.3, 0.38)
  Top 0.254: MSP1.5 30.78,24.04 | 29.3,28.5 C4.1 | R1.2 10.42,43.28 v10.18,43.05 | 29.62,31.29 29.62,30.86 C5.1
  Top 0.406: J1.1 6.38,35.48
  Top 0.508: 29.3,28.5 29.3,24.57 29.83,24.04 30.78,24.04 | C5.1 29.66,29.83 29.34,29.52 29.34,28.57 C4.1 | J1.1 3.58,35.56 2.69,34.67 2.69,12.57 4.85,10.41 10.82,10.41 11.84,9.4 11.84,6.35 13.87,4.32 19.33,4.32 22.88,0.76 50.32,0.76 J5.1 | v10.18,38.1 11.84,36.45 29.74,36.45 | 29.62,31.29 29.62,36.32 29.74,36.45 | 29.74,36.45 35.2,36.45 36.86,38.1 J101.10
  Bottom 0.203: v10.18,43.05 v10.18,38.1
  Bottom 0.508: J1.1 8.91,38.1 v10.18,38.1
EZFET_AVBUS  (via drill 0.3)
  Top 0.203: v29.36,55.12 29.11,55.12 28.52,55.7 MSP101.1
  Top 0.254: C123.2 15.71,53.65 v15.77,53.72
  Top 0.305: 12.96,53.7 12.98,53.72 13.12,53.72 | 13.11,53.7 R125.1 | 13.23,53.72 13.12,53.72 | 13.12,53.72 R125.1 | R124.2 R125.1 | C123.2 13.16,53.65 R125.1
  Bottom 0.203: v29.36,55.12 27.02,55.12 23.98,52.07 17.42,52.07 v15.77,53.72
EZFET_AVCC  (via drill 0.3)
  Top 0.152: 38.51,65.01 38.51,65.02 MSP102.6
  Top 0.203: 23.01,70.22 v23.01,69.09 | v38.51,63.5 38.51,65.01
  Top 0.305: 23.01,70.22 C116.2 | 22.97,70.32 23.01,70.36 23.01,70.32 | 23.01,70.23 23.01,70.32 | 23.01,70.32 C116.2 | R114.2 18.95,68.88 18.95,69.85 19.41,70.32 21.59,70.32 R115.1 22.96,70.6 C116.2
  Bottom 0.203: v23.01,69.09 24.28,67.82 28.85,67.82 29.11,68.07 31.78,68.07 34.32,65.53 37.74,65.53 38.51,64.77 v38.51,63.5
EZFET_AVCCOUT  (via drill 0.3)
  Top 0.152: 36.73,67.94 36.86,67.94 MSP102.1
  Top 0.203: R113.1 41.81,57.91 41.81,56.9 41.83,56.9 R112.2 | R113.1 42.03,58.8 v42.75,58.8 | 36.73,67.94 36.27,68.38 36.27,69.14 36.73,69.6 v37.11,69.6 | 41.78,61.9 41.78,61.87 41.83,61.82 41.83,61.83 41.86,61.85 | 41.86,61.76 41.86,61.85 | 41.86,61.85 41.86,61.88 41.83,61.9 | C115.2 41.79,61.93 41.07,61.21 41.07,59.64 41.68,59.03 41.77,58.78 R113.1
  Top 0.508: C115.2 41.81,61.92 41.78,61.9
  Bottom 0.203: v37.11,69.6 41.94,69.6 45.11,66.42 45.09,61.16 43.61,59.69 v42.75,58.8
EZFET_AVCCOUT2ADC
  Top 0.203: MSP101.2 29.21,55.75 30.76,55.75 31.52,54.99 33.43,54.99 C122.2 34.92,54.65 R122.1 R121.2 | R121.2
EZFET_DCDCCAL0
  Top 0.203: R126.2 43.7,60.33 43.33,60.71 42.98,61.06 42.98,66.55 41.6,67.9 MSP102.12
EZFET_DCDCCAL1  (via drill 0.3)
  Top 0.203: MSP102.2 36.85,67.31 36.6,67.31 36.35,67.56 36.35,67.69 35.84,68.2 35.84,69.34 37.24,70.74 41.88,70.74 v42.75,69.88 | R127.2 43.67,57.45 43.66,57.81 43.66,58.27 43.69,58.29 43.66,58.29 v43.66,58.34
  Bottom 0.203: v42.75,69.88 45.54,67.03 45.54,60.2 v43.66,58.34
EZFET_DCDCCAL2
  Top 0.203: MSP102.11 40.63,67.26 41.63,67.26 42.55,66.34 42.55,60.39 43.67,59.26 R128.2
EZFET_DCDCIO0  (via drill 0.3)
  Top 0.203: v36.91,64.85 36.91,65.08 MSP102.4 | v31.93,62.43 31.93,60.73 29.49,58.29 29.49,57.6 MSP101.5
  Bottom 0.203: v36.91,64.85 35.31,64.85 32.92,62.46 32.16,62.46 v31.93,62.43
EZFET_DCDCIO1  (via drill 0.3)
  Top 0.203: 30.12,57.67 MSP101.6 30,57.8 30,58.29 32.35,60.59 32.36,60.61 32.36,61.47 v32.66,61.77 | v37.74,64.14 37.74,65.04 MSP102.5
  Bottom 0.203: v37.74,64.14 35.33,64.14 32.97,61.77 v32.66,61.77
EZFET_DCDCPULSE  (via drill 0.3)
  Top 0.203: R118.2 43.82,65.65 v43.82,65.35 | v39.27,62.61 38.18,62.61 35.97,64.77 35.97,66.68 | 35.97,66.68 35.97,67.54 35.31,68.2 33.55,68.2 31.78,66.42 30.63,66.42 30,65.79 MSP101.28 | 35.97,66.68 36.04,66.6 MSP102.3
  Bottom 0.203: v39.27,62.61 41.15,62.61 v43.82,65.35
EZFET_DCDCRST  (via drill 0.3)
  Top 0.203: MSP101.7 30.66,57.83 30.91,57.58 30.91,57.17 30.76,57.02 30.76,56.26 31.65,55.37 v37.74,55.37 | 40.78,65.91 MSP102.9 40.61,63.01 40.05,62.46 40.05,59.36 TP108.1 | TP108.1 39.42,58.7 39.37,58.75 TP108.1
  Top 0.305: TP108.1
  Bottom 0.203: TP108.1 | TP108.1 37.74,57.02 v37.74,55.37
EZFET_DCDCTEST
  Top 0.203: MSP101.8 31,58.18 31.37,57.81 31.37,57.12 31.14,56.9 31.14,56.39 31.78,55.75 35.46,55.75 35.84,56.13 TP109.1 39.8,56.54 40.56,57.3 40.56,62.38 41,62.81 41,64.85 41.43,65.28 41.43,66.29 41.12,66.6 40.74,66.6 40.66,66.67 40.66,66.55 MSP102.10
EZFET_DM  (via drill 0.3)
  Top 0.203: J102.2 10.04,68.59
  Top 0.254: IC102.4 10.17,61.99 v10.57,61.59 | 10.04,68.59 v10.06,64.52
  Top 0.305: v10.57,61.59 11.58,61.59 11.61,61.56 R103.1
  Bottom 0.254: v10.57,61.59 9.68,62.48 9.68,64.14 v10.06,64.52
EZFET_DP  (via drill 0.3)
  Top 0.254: v8.2,63.93 v8.21,63.94 IC102.1 7.52,62.99 7.14,62.61 7.14,61.34 10.18,58.29 11.5,58.29 R104.1 | J102.3 v10.69,65.41
  Bottom 0.254: v10.69,65.41 9.68,65.41 v8.2,63.93
EZFET_HOSTSCL  (via drill 0.3)
  Top 0.152: MSP101.35 26.95,66.55 26.95,66.54
  Top 0.203: 26.95,66.54 26.83,66.54 26.19,67.18 v26.19,68.71 26.19,70.18 | v39.27,64.14 39.09,64.29 MSP102.7
  Top 0.305: 26.19,70.18 R117.2
  Bottom 0.203: v26.19,68.71 26.57,68.33 28.73,68.33 28.85,68.45 32.03,68.45 34.44,66.04 38,66.04 39.27,64.77 v39.27,64.14
EZFET_HOSTSDA  (via drill 0.3)
  Top 0.203: MSP101.34 27.28,66.85 26.82,67.31 26.82,68.83 v27.08,69.09 27.08,70.09 R116.2 | MSP102.8 39.88,64.91 v39.88,63.37
  Bottom 0.203: v27.08,69.09 27.33,68.83 32.28,68.83 34.57,66.55 38.25,66.55 39.88,64.92 v39.88,63.37
EZFET_LED0  (via drill 0.3)
  Top 0.203: MSP101.20 33.17,63.37 v33.17,65.41 | v31.52,67.18 30.34,68.37 R101.2
  Bottom 0.203: v33.17,65.41 33.17,65.53 v31.52,67.18
EZFET_LED1  (via drill 0.3)
  Top 0.203: 30.23,70.22 R102.2 29.85,70.34 29.49,69.98 29.49,68.58 30.5,67.56 v30.5,67.06 | MSP101.21 32.41,63.38 32.79,63.75 32.79,64.52 v32.41,64.9
  Bottom 0.203: v32.41,64.9 32.41,65.15 v30.5,67.06
EZFET_PU.0/DP  (via drill 0.3)
  Top 0.152: 22.76,60.71 MSP101.50
  Top 0.203: v16.1,59.26 15.33,58.48 C111.1 | R104.2 13.39,57.71 13.46,57.63 14.56,57.63 C111.1 | 15.15,58.28 C111.1 | 22.76,60.71 22.5,60.45 22.45,60.45 22.35,60.35 v21.64,60.35 | 15.18,58.46 C111.1 | R105.1 15.15,60.36 R106.1 15.15,58.43 C111.1
  Bottom 0.203: v16.1,59.26 17.2,60.35 v21.64,60.35
EZFET_PU.1/DM  (via drill 0.3)
  Top 0.203: 12.74,61.5 R103.2 11.62,60.31 C110.1 10.82,59.94 10.57,59.69 v10.57,59.05 | MSP101.52 23,59.56 22.5,59.56 v22.33,59.64
  Bottom 0.203: v22.33,59.64 17.5,59.64 16.15,58.29 11.33,58.29 v10.57,59.05
EZFET_PUR  (via drill 0.3)
  Top 0.203: MSP101.51 23.52,60.78 v23.77,61.09 | v15.24,62.41 15.25,61.63 R105.2
  Bottom 0.203: v15.24,62.41 22.45,62.41 v23.77,61.09
EZFET_RST  (via drill 0.3)
  Top 0.203: MSP101.64 27.79,55.55 28.63,54.7 C112.1 | 28.6,54.3 C112.1 | C112.1 30.09,54.29 R109.1 30.14,53.71 30.63,53.21 v31.27,53.21 | TP107.1 | TP107.1 v33.05,51.94
  Bottom 0.203: v33.05,51.94 31.78,53.21 v31.27,53.21
EZFET_SBWTCK  (via drill 0.3)
  Top 0.203: MSP101.44 23.75,63.32 24.03,63.04 v24.03,62.23 | v41.25,53.34 41.25,51.49 43.18,49.55 45.09,49.55 46.38,48.26 J101.1
  Bottom 0.203: v24.03,62.23 24.28,61.98 25.04,61.98 31.65,55.37 31.65,53.85 32.28,53.21 35.46,53.21 36.86,51.82 39.73,51.82 v41.25,53.34
EZFET_SBWTDIO  (via drill 0.3)
  Top 0.203: MSP101.43 24.12,63.66 24.79,62.99 v24.79,62.74 | J101.3 43.79,48.26 42.55,49.51 42.52,49.51 40.21,51.82 v40.21,53.34
  Bottom 0.203: v24.79,62.74 32.03,55.5 32.03,53.98 32.41,53.59 35.59,53.59 36.98,52.2 39.07,52.2 v40.21,53.34
EZFET_SHIELD  (via drill 0.3)
  Top 0.152: 14,68.96 13.87,68.83 13.87,68.71
  Top 0.203: 7.44,67.06 7.52,67.06 v7.52,67.18 | 7.44,68.71 7.39,68.71 | 7.39,68.71 7.39,69.22 | v6.76,68.71 7.39,68.71 | v14.63,68.71 13.87,68.71
  Top 0.254: R123.1 12.91,63.44 13.87,64.39 v13.87,67.18
  Top 0.305: IC102.5 12.21,62.49 12.34,62.48 12.73,62.87 12.73,63.27 R123.1 12.73,63.17 | 7.44,67.06 7.44,68.71 | v13.87,67.18 13.87,68.71
  Top 0.381: J102.S2 7.41,69.33 6.12,70.61 6.12,71.88 6.14,71.9 J102.S4 | J102.S4 v6.14,71.86 v6.15,71.86 | 14,68.96 14,69.38 | J102.S2 7.44,69.27 7.39,69.22 | v8.05,69.95 8.05,69.94 J102.S2 | v13.28,69.98 v13.29,69.98 J102.S1 14,69.38 | 14,69.38 14,69.47 15.14,70.61 15.14,71.09 v14.88,71.35 14.88,71.57 J102.S3 | v15.59,72.16 15.59,71.9 J102.S3 | J102.S3 15.22,71.91 J102.S5 11.68,71.91 v11.61,71.98 | 9.68,71.98 6.2,71.98 J102.S4
  Top 0.406: J102.S6 9.68,71.98 v9.7,71.98
  Bottom 0.305: v7.52,67.18 v13.87,67.18
EZFET_TCK  (via drill 0.3)
  Top 0.203: v28.35,57.15 27.31,56.11 MSP101.63
  Bottom 0.203: TP106.1 | v28.35,57.15 29.36,57.15 30.63,55.88 30.63,51.82 TP106.1 | TP106.1
EZFET_TDI
  Top 0.203: MSP101.61 26.59,56.79 26.19,56.39 26.19,55.5 26.7,54.99 TP104.1 | TP104.1
EZFET_TDO
  Top 0.203: TP103.1 24.15,51.69 26.31,53.85 26.31,54.86 25.81,55.37 25.81,56.71 MSP101.60
EZFET_TEST
  Top 0.203: 25.93,57.53 25.92,57.53 MSP101.59 25.43,57.03 25.43,55.24 25.93,54.74 25.93,54.1 22.5,50.67 TP102.1
EZFET_TMS
  Top 0.203: MSP101.62 26.95,56.39 26.57,56.01 26.57,55.63 27.08,55.12 27.08,52.83 TP105.1
EZFET_UARTRXD  (via drill 0.3)
  Top 0.203: MSP101.38 26.31,65.02 26.31,64.77 26.44,64.64 v26.44,64.14 | J101.5 41.94,49.43 39.19,52.17 39.19,53.31 v39.22,53.34
  Bottom 0.203: v26.44,64.14 30.63,59.94 33.81,59.94 35.2,58.55 35.2,54.48 37.11,52.58 38.46,52.58 v39.22,53.34
EZFET_UARTTXD  (via drill 0.3)
  Top 0.203: MSP101.37 26.25,65.73 v26.95,65.02 | v38.23,53.34 38.23,52.6 39.4,51.44 J101.7
  Bottom 0.203: v26.95,65.02 27.08,64.01 30.76,60.33 33.93,60.33 35.59,58.67 35.59,54.61 37.24,52.96 37.85,52.96 v38.23,53.34
EZFET_V18
  Top 0.203: MSP101.55 24.45,58.89 23.21,57.66 22.12,57.66 19.22,54.75 C102.1
EZFET_VBUS  (via drill 0.3)
  Top 0.203: 9.3,63.12 9.3,62.99 IC102.6 | 9.55,63.12 IC102.6 | IC102.6 | 51.1,67.59 51.1,67.86 C109.+
  Top 0.254: IC103.2 50.32,53.34
  Top 0.305: MSP101.53 23.11,58.95 19.61,58.95 17.3,56.64 13.36,56.64 11.71,54.99 11.33,54.99 | 19.33,61.72 IC101.1 IC101.6 | 51.06,63.59 51.06,64.76 C118.1 51.11,65.83 R120.1
  Top 0.406: 50.32,53.34 C125.1 49.3,53.34
  Top 0.508: 9.3,65.02 9.3,63.12 | 9.55,63.12 v10.69,63.63 | 9.3,65.02 7.14,65.02 5.99,63.88 5.99,60.3 11.33,54.99 11.45,54.8 R124.1 10.48,54.9 9.8,54.23 9.8,49.78 11.33,48.26 29.74,48.26 30.96,49.48 33.1,49.48 J101.11 | v18.31,63.63 18.69,64.01 18.69,64.26 19.07,64.64 19.04,64.64 C108.1 19.37,64.6 19.96,64.01 19.96,62.36 19.33,61.72 | J102.1 9.39,65.12 9.3,65.02 | 51.1,67.59 51.1,65.94 51.06,65.89 R120.1 | 51.06,64.81 C118.1 | 51.06,63.59 C117.1 51.03,63.55 51.59,62.99 51.59,62.36 51.61,62.36 v51.64,62.38 | T101.2 49.32,60.31 | 49.32,60.31 49.3,60.33 | v49.33,60.27 49.33,60.3 49.32,60.31 | v49.05,54.86 49.3,54.61 49.3,53.38 C125.1
  Top 0.635: C109.+ 50.62,67.81 50.39,67.79 v49.48,67.79
  Bottom 0.305: 48.87,67.74 48.74,67.79
  Bottom 0.508: v10.69,63.63 v18.31,63.63 20.47,65.79 20.47,69.72 22.38,71.63 44.86,71.63 48.74,67.79 v49.48,67.79 | v51.64,62.38 50.62,62.38 49.33,61.09 v49.33,60.27 49.33,58.95 48.03,57.66 48.03,55.88 v49.05,54.86
EZFET_VCC  (via drill 0.3)
  Top 0.152: MSP101.11 32.03,59.31 32.07,59.27 | 33.86,58.73 C114.1 | 33.43,60.71 MSP101.15
  Top 0.203: 24.66,65.25 MSP101.40 | R116.1 27.08,71.37 | C114.1 34.06,59.05 | 33.86,58.73 34.12,58.99 | 34.95,66.67 34.98,66.7 | R109.2 32.6,54.24 v32.79,54.3
  Top 0.254: 17.93,61.47 IC101.3 | IC103.4 51.59,52.32 | C103.1 23.1,66.2 23.05,66.25
  Top 0.305: MSP101.40 25.19,64.75 24.28,65.66 C103.1 | 25.52,71.28 R117.1 25.44,71.25 | 46.17,71.66 C124.1 46.04,71.14 45.99,71.03 | 48.14,69.64 C106.+ | 43.59,70.74 45.69,70.74 45.99,71.03 | 38.42,68.75 38.38,68.96 38.38,69.47 39.14,70.23 41.3,70.23 43.46,68.07 46.76,68.07 47.55,68.87 C106.+ | 38.42,68.75 38.43,68.68 | 33.6,60.55 MSP101.15 | 32.07,59.27 32.66,58.67 v32.92,58.67 33.76,58.67 34.12,58.99 35.08,59.94 | v37.11,68.63 37.64,68.63 MSP102.16 MSP102.15 38.42,68.75 | C106.+ 47.73,69.31 47.9,69.52 v47.9,70.74 | 46.06,70.98 45.99,71.03 | 35.08,59.94 35.38,59.77 36.55,59.77 38,61.21 38,62.1 35.46,64.64 35.46,66.17 34.98,66.65 34.98,66.7 v34.98,67.39 | 35.08,59.94 35.14,59.94 C113.1 | 35.08,59.94 34.19,59.94 33.43,60.71 | 23.05,66.25 21.49,67.82 21.49,67.94 C104.+
  Top 0.406: 17.85,61.81 17.93,61.68 17.93,61.47 | 17.42,64.39 17.3,64.39 C105.1 16.88,64.55
  Top 0.508: 16.88,64.55 16.03,65.41 16.03,67.56 16.28,67.82 18.91,67.82 R114.1 21.26,67.78 C104.+ 23.42,67.97 24.03,68.58 24.03,70.61 24.66,71.25 25.44,71.25 27,71.25 R116.1 27.26,71.31 27.96,72.01 42.32,72.01 43.59,70.74 45.62,70.74 46.02,71.07 46.02,71.58 | 17.85,61.81 17.42,62.23 17.42,64.39 17.34,64.6 17.35,64.6 | v47.9,70.74 47.02,71.63 C124.1 | v55.14,51.54 55.14,51.56 54.89,51.31 52.1,51.31 51.59,51.82 51.59,52.32
  Bottom 0.203: v32.92,58.67 32.92,54.43 v32.79,54.3
  Bottom 0.305: v37.11,68.63 36.22,68.63 v34.98,67.39
  Bottom 0.508: v47.9,70.74 49.68,70.74 55.14,65.28 v55.14,51.54
EZFET_VCCEN1  (via drill 0.3)
  Top 0.203: MSP101.26 30.69,65.08 31.14,65.53 32.03,65.53 32.66,66.17 33.55,66.17 34.57,65.15 34.57,64.39 36.32,62.64 v36.32,61.57 | v50.06,52.32 50.32,52.32 50.83,52.84 IC103.3 | R107.1 43.15,55.81 v43.21,56.13
  Bottom 0.203: v50.06,52.32 49.68,52.32 47.78,54.23 45.11,54.23 v43.21,56.13 43.08,56.26 41.3,56.26 40.54,57.02 40.54,60.71 39.9,61.34 36.55,61.34 v36.32,61.57
EZFET_VCCEN2  (via drill 0.3)
  Top 0.203: MSP101.27 30.76,65.91 31.78,65.91 32.41,66.55 33.81,66.55 34.95,65.41 34.95,64.52 37.11,62.36 v37.11,62.05 | R108.1 v44.35,56.13 | IC103.7 52.47,53.84 52.73,54.1 v52.73,54.61
  Bottom 0.203: v52.73,54.61 52.48,54.86 50.06,54.86 49.3,54.1 48.54,54.1 48.03,54.61 45.87,54.61 v44.35,56.13 43.71,56.77 41.55,56.77 41.05,57.28 41.05,60.83 39.9,61.98 37.19,61.98 v37.11,62.05
EZFET_VCCOUT
  Top 0.203: 41.81,55.74 40.69,54.61 40.5,54.42 37.27,54.42 36.18,53.33 R121.1 | 41.81,55.74 41.81,55.75 41.94,55.75 42.95,56.77 44.22,56.77 44.73,57.28 44.73,57.31 R127.1 | 41.81,55.74 R112.1 | R128.1 R126.1
  Top 0.254: 51.59,54.36 IC103.8
  Top 0.305: C120.1 45.4,55.38 45.4,56.9 R127.1 44.87,59.13 R128.1 | 46.62,55.41 46.62,55.38
  Top 0.508: 50.55,55.85 50.55,55.4 51.59,54.36
  Top 0.635: 46.62,55.41 47.19,55.85 50.43,55.85 C119.1 50.46,55.83 50.47,55.83 | L101.2 50.44,57.75 50.44,56.11 50.42,56.11 50.42,56.01 50.55,56.01 50.55,55.85 50.47,55.85 50.47,55.83 | 50.47,55.8 50.47,55.83 | 46.62,55.38 C120.1
EZFET_VCCTARGET  (via drill 0.3)
  Top 0.254: IC103.5 52.21,52.84
  Top 0.305: IC103.1 50.71,53.84 v50.32,54.23 | 52.21,52.84 52.6,52.84 52.73,52.7 v52.73,52.15
  Bottom 0.508: v50.32,54.23 51.59,54.23 52.73,53.09 v52.73,52.15 50.5,49.91 38.51,49.91 J101.9
EZFET_VCORE
  Top 0.203: MSP101.17 34.93,63 C101.1
EZFET_VREF
  Top 0.203: C121.1 31.98,56.68 31.98,57.94 MSP101.9
EZFET_VUSB
  Top 0.305: MSP101.54 23.04,58.18 20.36,58.18 20.09,57.91 | C107.1 20.09,57.91 | 20.09,57.91
EZFET_XT2IN
  Top 0.203: MSP101.57 25.16,58.21 24.23,57.25 23.24,57.25 22.06,56.07 22,56.01
  Top 0.406: Q101.1 22.06,56.01 22.06,56.07
EZFET_XT2OUT
  Top 0.203: MSP101.58 24.79,57.1 24.79,54.74 24.2,54.15
  Top 0.406: Q101.3 24.2,53.89 24.2,54.15
GND  (via drill 0.3)
  Top 0.152: v25.17,67.18 25.17,65.41 25.43,65.15 MSP101.39 | MSP102.TP 38.76,68.33 39.14,68.71 MSP102.14 | 26.79,59.98 26.82,59.94 MSP101.TP 27.2,60.58
  Top 0.203: 33.63,61.24 33.53,61.24 | 33.63,61.24 33.63,61.23 MSP101.16 | MSP101.56 24.83,58.59 | MSP101.39 25.93,64.69 25.93,64.54 25.75,64.36 | MSP101.14 32.79,60.66 32.79,60.98 33.1,61.32 33.53,61.32 33.63,61.24 | C101.2 34,64.63 v33.91,64.72
  Top 0.254: 24.83,58.59 24.86,58.59 25.12,58.85 v25.12,60.1 | Q101.2 22.95,54.83 21.61,53.49 | C121.2 32.94,57.25 33.43,56.77
  Top 0.305: 21.61,53.49 18.45,53.47 C102.2
  Bottom 0.203: v20.68,54.25 21.23,54.25 21.72,54.74
  other vias: 10.57,57.66 8.89,58.67 51.08,72.14 41.45,68.71 24.18,56.62 35.33,61.21 19.96,72.39 23.01,65.28 53.49,53.29 43.69,69.88 46.18,56.62 45.75,58.45 47.83,66.17 44.09,63.12 52.7,70.87 17.25,69.98 47.07,72.39 35.59,62.38 48.34,60.96 49.1,64.8 8.43,54.56 16.59,55.91 25.17,68.81 28.85,69.82 17.07,54.69 22.35,52.81 18.95,56.46 27.41,57.3 30.66,63.5 12.22,52.07 22.12,69.49 5.18,62.48 5.23,66.17 16.66,72.26 5.79,69.44 15.72,64.41 13.49,59.18 11.66,64.47 14.88,67.18 16.1,60.33 8.41,61.21 11.45,66.42 27.69,53.75 47.8,62.08 38.4,60.45 41.6,64.08 42.49,57.78 49.76,69.04 21.61,63.37 41.81,60.93 7.9,51.94 1.17,53.21 1.17,62.1 1.17,67.56 21.74,72.39 57.2,50.6 57.48,58.9 57.53,63.5 57.53,67.51 54.69,66.88 56.44,57.02 54.64,49.91 25.43,49.66 30.12,47.5 15.77,49.66 25.91,52.43 6.04,57.02 19.15,63.12 17.3,57.78 26.59,61.98 28.19,60.3 38.15,67.44 39.42,66.55 21.49,61.47 7.21,63.83 12.85,66.42 13.36,62.48 28.9,63.73 53.64,62.51 37.72,59.74 34.04,56.44 52.86,50.34 49.02,56.9 54.05,56.39 50.06,50.75 53.44,55.42 45.67,52.81 51.26,60.96 28.88,65.28 36.12,70.61 42.24,54.58 37.11,51.05 45.39,51.89 42.75,52.02 29.64,53.14 33.96,52.4 31.52,52.32 35.71,50.55
  pour Top: 0.02,47.24 58.45,47.24 58.45,73.66 0.02,73.66
  pour Bottom: 0.02,47.24 58.45,47.24 58.45,73.66 0.02,73.66
N$3
  Top 0.254: R6.1 41.82,7.57 J11.2
N$4
  Top 0.254: R6.2 43.12,3.48 LED2.A
N$6
  Top 0.254: J10.2 38.58,4.86 R2.1
N$7
  Top 0.254: R2.2 37.12,3.22 LED1.A
N$9
  Top 0.203: 32.66,68.96 32.82,69.11 | 32.82,69.11 32.92,69.22 | R101.1 32.66,69.22 | 32.66,69.22 | 32.82,69.11 LED101.A 32.66,69.2 32.66,69.22
N$12
  Top 0.305: T102.2 46.78,61.33 46.76,61.34 45.87,61.34 45.53,61.68 R119.1
N$13
  Top 0.254: T102.1 D101.2 D101.1 46.27,66.82 45.87,66.42 44.98,66.42 R118.1
  Top 0.305: R118.1 44.79,66.43
N$15
  Top 0.635: L101.1 53.23,58.58 53.23,58.67 | 53.23,58.67 53.24,59.69 53.24,60.2 52.48,60.96 T101.3 | D102.3 48.68,58.94 49.17,59.44 52.35,59.44 53.11,58.67 53.23,58.67
N$16
  Top 0.203: T102.3 48.8,61.97 48.29,62.48 48.29,65.66 48.79,66.17 49.68,66.17 49.96,65.89 R120.2 | T101.1 50.38,61.66 50.06,61.98 T102.3 | 48.79,61.98 T102.3
  Top 0.406: 48.79,66.17 D101.3
N$20
  Top 0.203: R102.1 32.14,70.34 32.73,70.93 | 32.73,70.93 32.79,70.99 | LED102.A 32.76,70.9 32.73,70.93
P1.0_IO_J1.5  (via drill 0.3)
  Top 0.254: MSP1.2 30.49,22.08 29.87,21.46 v29.87,14.86 32.79,11.94 37.95,11.94 38.58,11.3 J10.1 | v14.76,11.3 v17.55,11.3
  Bottom 0.254: v14.76,11.3 5.74,11.3 4.6,12.45 4.6,24.38 5.61,25.4 J1.5 | v17.55,11.3 17.55,12.7 19.71,14.86 v29.87,14.86
P1.1_IO_J2.11  (via drill 0.3)
  Top 0.254: J2.11 33.05,12.7 30.63,15.11 v30.63,16.89 30.63,20.95 31.12,21.45 MSP1.1
  Bottom 0.254: S1.1 16.28,7.75 16.28,14.86 18.31,16.89 v30.63,16.89
P1.2_I2CSDA_J1.10
  Top 0.254: J1.10 16.54,12.7 17.17,13.34 17.17,21.08 17.54,21.45 MSP1.20 26.57,21.42 27.5,21.42 27.96,20.95 27.96,13.08 25.19,10.31 J7.1
P1.2_OPAMP-_J1.10
  Top 0.254: J7.2 25.19,6.33 25.55,5.97 26.64,5.97 27.28,5.33 D1.C R3.1 C6.1
P1.3_I2CSCL_J1.9
  Top 0.254: J1.9 15.27,15.24 16.54,16.51 16.54,21.59 17.03,22.08 MSP1.19 27.95,22.08 28.73,21.3 28.73,12.7 27.73,11.71 J8.1
P1.3_OPAMPOUT_J1.9
  Top 0.254: J8.2 27.73,6.71 28.73,5.71 31.39,5.71 32.22,4.89 R3.2 32.2,4.29 C6.2
P1.4_A4_J1.2
  Top 0.254: J1.2 4.6,31.24 4.6,22.61 5.61,21.59 7.01,21.59 8.16,22.74 MSP1.18 28.34,22.74 29.23,21.84 29.23,14.22 30.27,13.19 J9.1
P1.5_A5_J1.6
  Top 0.254: MSP1.17 6.92,23.4 J1.6
P1.6_URXD_J1.3  (via drill 0.3)
  Top 0.254: J1.3 6.5,30.35 12.98,30.35 | 12.98,30.35 16.41,30.35 17.17,31.11 v17.17,34.8 | v17.17,37.21 17.17,40.89 17.93,41.66 v32.51,41.66 | MSP1.16 16.88,24.04 13.36,27.56 13.36,29.97 12.98,30.35 | v39.4,41.66 J101.8
  Bottom 0.254: v17.17,34.8 v17.17,37.21 | v32.51,41.66 v39.4,41.66
P1.7_UTXD_J1.4  (via drill 0.3)
  Top 0.254: MSP1.15 17.24,24.7 v14,27.94 14,29.21 14.63,29.84 16.66,29.84 17.68,30.86 17.68,34.16 18.19,34.67 v18.19,34.8 | v11.45,27.94 J1.4 | v18.19,37.34 17.68,37.85 17.68,40.77 18.06,41.15 31.09,41.15 v31.34,40.89 | J101.6 41.94,41.76 41.07,40.89 v40.84,40.89
  Bottom 0.254: v11.45,27.94 v14,27.94 | v18.19,37.34 v18.19,34.8 | v31.34,40.89 v40.84,40.89
P2.0_PWM_J2.19  (via drill 0.3)
  Top 0.254: MSP1.14 27.39,25.33 27.84,25.78 v27.84,28.19 | J11.1 v41.78,11.81 | v31.42,20.52 31.34,20.45 31.34,15.34 33.25,13.44 v41.81,13.44 | v32.54,30.73 33.05,30.73 33.81,31.5 50.57,31.5 J2.19
  Bottom 0.254: v32.54,30.73 32.54,29.59 31.9,28.96 28.22,28.96 27.84,28.57 v27.84,28.19 27.84,22.2 29.51,20.52 v31.42,20.52 | v41.78,11.81 41.78,13.41 v41.81,13.44
P2.1_IO_J1.8  (via drill 0.3)
  Top 0.254: MSP1.13 24.62,25.99 v24.41,25.78
  Bottom 0.254: v24.41,25.78 24.41,18.16 24.03,17.78 J1.8
P2.2_IO_J2.18  (via drill 0.3)
  Top 0.254: MSP1.12 23,26.65 v22.5,26.16 | v31.14,29.72 32.79,29.72 34.06,30.99 47.52,30.99 48.03,30.48 J2.18
  Bottom 0.254: v22.5,26.16 23,26.65 24.41,26.65 27.47,29.72 v31.14,29.72
P2.3_SPICLK_J1.7  (via drill 0.3)
  Top 0.254: MSP1.11 23.92,27.29 v23.65,27.56
  Bottom 0.254: v23.65,27.56 23.52,27.43 17.3,27.43 16.54,26.67 16.54,20.95 15.9,20.32 J1.7
P2.4_SPIMOSI_J2.15  (via drill 0.3)
  Top 0.254: MSP1.10 32.18,28.35 33.05,29.21 33.05,29.22 34.33,30.5 47.25,30.5 48.29,29.46 v48.29,24.13
  Bottom 0.254: v48.29,24.13 48.29,23.62 49.05,22.86 J2.15
P2.5_SPIMISO_J2.14  (via drill 0.3)
  Top 0.254: MSP1.9 33.03,26.65 33.68,27.3 33.68,29.16 34.53,30 47.1,30 47.78,29.32 47.78,25.4 v47.52,25.15
  Bottom 0.254: v47.52,25.15 47.52,21.08 48.29,20.32 J2.14
P2.6_IO_J2.12  (via drill 0.3)
  Top 0.254: R4.2 45.23,29.2 46.23,28.2 v46.23,23.6 | v46.23,20 46.23,16.03 47.02,15.24 J2.12
  Bottom 0.254: v46.23,23.6 v46.23,20
P2.7_IO_J2.13  (via drill 0.3)
  Top 0.254: R5.2 v45.12,23.5
  Bottom 0.254: v45.12,23.5 45.12,19.2 46.55,17.78 J2.13
RST_RST_J2.16  (via drill 0.3)
  Top 0.254: v41.25,21.97 48.67,21.97 J2.16 | MSP1.4 30.67,23.4 v30,22.73 | S2.1 7.52,45.09 12.85,45.09 13.05,44.89 C1.1 13.07,44.42 13.07,43.3 R1.1 v32.92,43.28 | J101.4 v44.48,43.28 44.48,38.1 47.9,34.67 v48.29,34.67
  Bottom 0.254: v30,22.73 30,22.35 30.63,21.97 v41.25,21.97 | J2.16 49.55,25.4 48.29,26.67 v48.29,34.67 | v32.92,43.28 v44.48,43.28
TEST_IO  (via drill 0.3)
  Top 0.254: v49.55,28.45 49.55,24.13 48.17,22.74 MSP1.3 | v49.55,32.26 49.55,35.56 47.02,38.1 J101.2
  Bottom 0.254: v49.55,28.45 v49.55,32.26
TGT_GND  (via drill 0.3)
  Top 0.254: C3.2 40.45,24.55 Y1.GND@0 | C2.2 40.46,28.16 Y1.GND@0 | Y1.GND@0 44.72,26.36 v44.73,26.35
  other vias: 23.9,44.83 22,34.54 15.77,42.42 16.54,31.75 25.43,39.37 40.64,44.45 54.64,43.18 37.82,34.26 43.97,20.95 39.8,11.86 55.91,7.62 21.72,13.29 9.93,13.84 14,13.97 30.52,27.48 30.44,25.58 33.62,24.45 28.89,5.03 26.82,31.75 10.82,44.32 40.31,4.45 18.19,26.04 14.25,24.51 9.04,26.54 9.68,29.08 18.57,28.96 22.63,28.57 21.49,32 10.67,32.08 10.57,34.54 16.03,34.67 28.6,34.42 30.63,34.42 38.3,42.49 44.48,32.89 38.12,44.5 32.54,31.75 55.52,31.62 54.89,38.1 55.65,24 55.65,18.67 55.65,11.18 54,6.1 44.48,11.3 49.68,10.54 33.88,14.22 33.93,21.08 48.92,13.84 48.92,19.05 49.94,21.46 15.52,21.97 9.17,21.34 9.04,18.8 15.65,18.8 14.76,16.38 9.3,16.51 18.31,20.45 26.82,15.88 18.44,15.37 2.18,7.37 3.71,31.75 3.71,13.59 10.18,9.02 13.49,1.27 20.22,1.27 22.73,7.42 33.48,1.73 31.39,12.06 12.85,10.16 22.76,10.16 2.31,44.96 1.68,37.72 14.96,39.7 11.28,41.99 14,45.59 19.84,38.23 28.27,37.39 43.46,35.05 51.08,43.18 51.33,38.73 43.36,13.64 40.74,14.27 45.11,17.53 37.49,20.19 22.25,20.19 29.49,12.83 26.95,20.32 25.55,17.65 26.95,13.97 32.52,7.57 22.69,4.27 28.96,3.41 32.33,19.68 32.28,15.75 47.52,16.51 28.85,23.62 23.37,25.48 44.5,1.91 36.91,8.46 36.02,1.73 43.64,8.33 50.24,8.59 50.37,4.14 40.59,42.32 33.1,44.35 31.67,37.29 35.59,44.4 35.56,40.08 45.64,43.31 48.11,35.71 45.85,38.48 50.34,29.54 43.1,42.34
  pour Bottom: 0.02,46.48 0.02,0 58.45,0 58.45,46.48
  pour Top: 0.02,46.48 0.02,0 58.45,0 58.45,46.48
XIN
  Top 0.254: Y1.1 36.04,23.8 | R5.1 36.37,23.5 Y1.1 | MSP1.7 36.03,25.33 36.09,25.27 | 36.09,25.27 36.09,23.88 Y1.1 | C3.1 37.45,24.55 36.73,25.27 36.09,25.27
XOUT
  Top 0.254: R4.1 36.35,29.2 Y1.2 35.97,28.82 35.97,27.3 | MSP1.8 33.77,25.99 34.95,27.18 35.97,27.18 35.97,27.3 | C2.1 37.46,28.16 36.6,27.3 35.97,27.3

### Text on the board
tPlace: RST | P1.2 | P1.3 | P1.4 | P1.0 | P2.0 | P1.1 | Light Sensor / Circuit
tDocu: IC103 | eZ-FET Rev1.3 | Rev1.0 | MSP-EXP430FR2311 | MSP430FR2311 | RXD << | TXD >> | SBWTDIO | SBWTCK | P1.4 | PWM | LaunchPad | P2.0 | P1.6 | I/O | P2.2 | P1.7 | <<TXD | NC | P1.0 | I/O! | !RST | P1.5 | MOSI | A5 | P2.4 | P2.3 | MISO | SCLK | P2.5 | P2.1 | I/O! | I/O! | P2.7 | P1.3 | I/O! | SCL | P2.6 | P1.2 | I/O! | SDA | P1.1
tSilk: J | C